# EasyEDA Pro project ProPrj_智能视觉主板1_2024-08-31.epro

# Schematic 主板_1
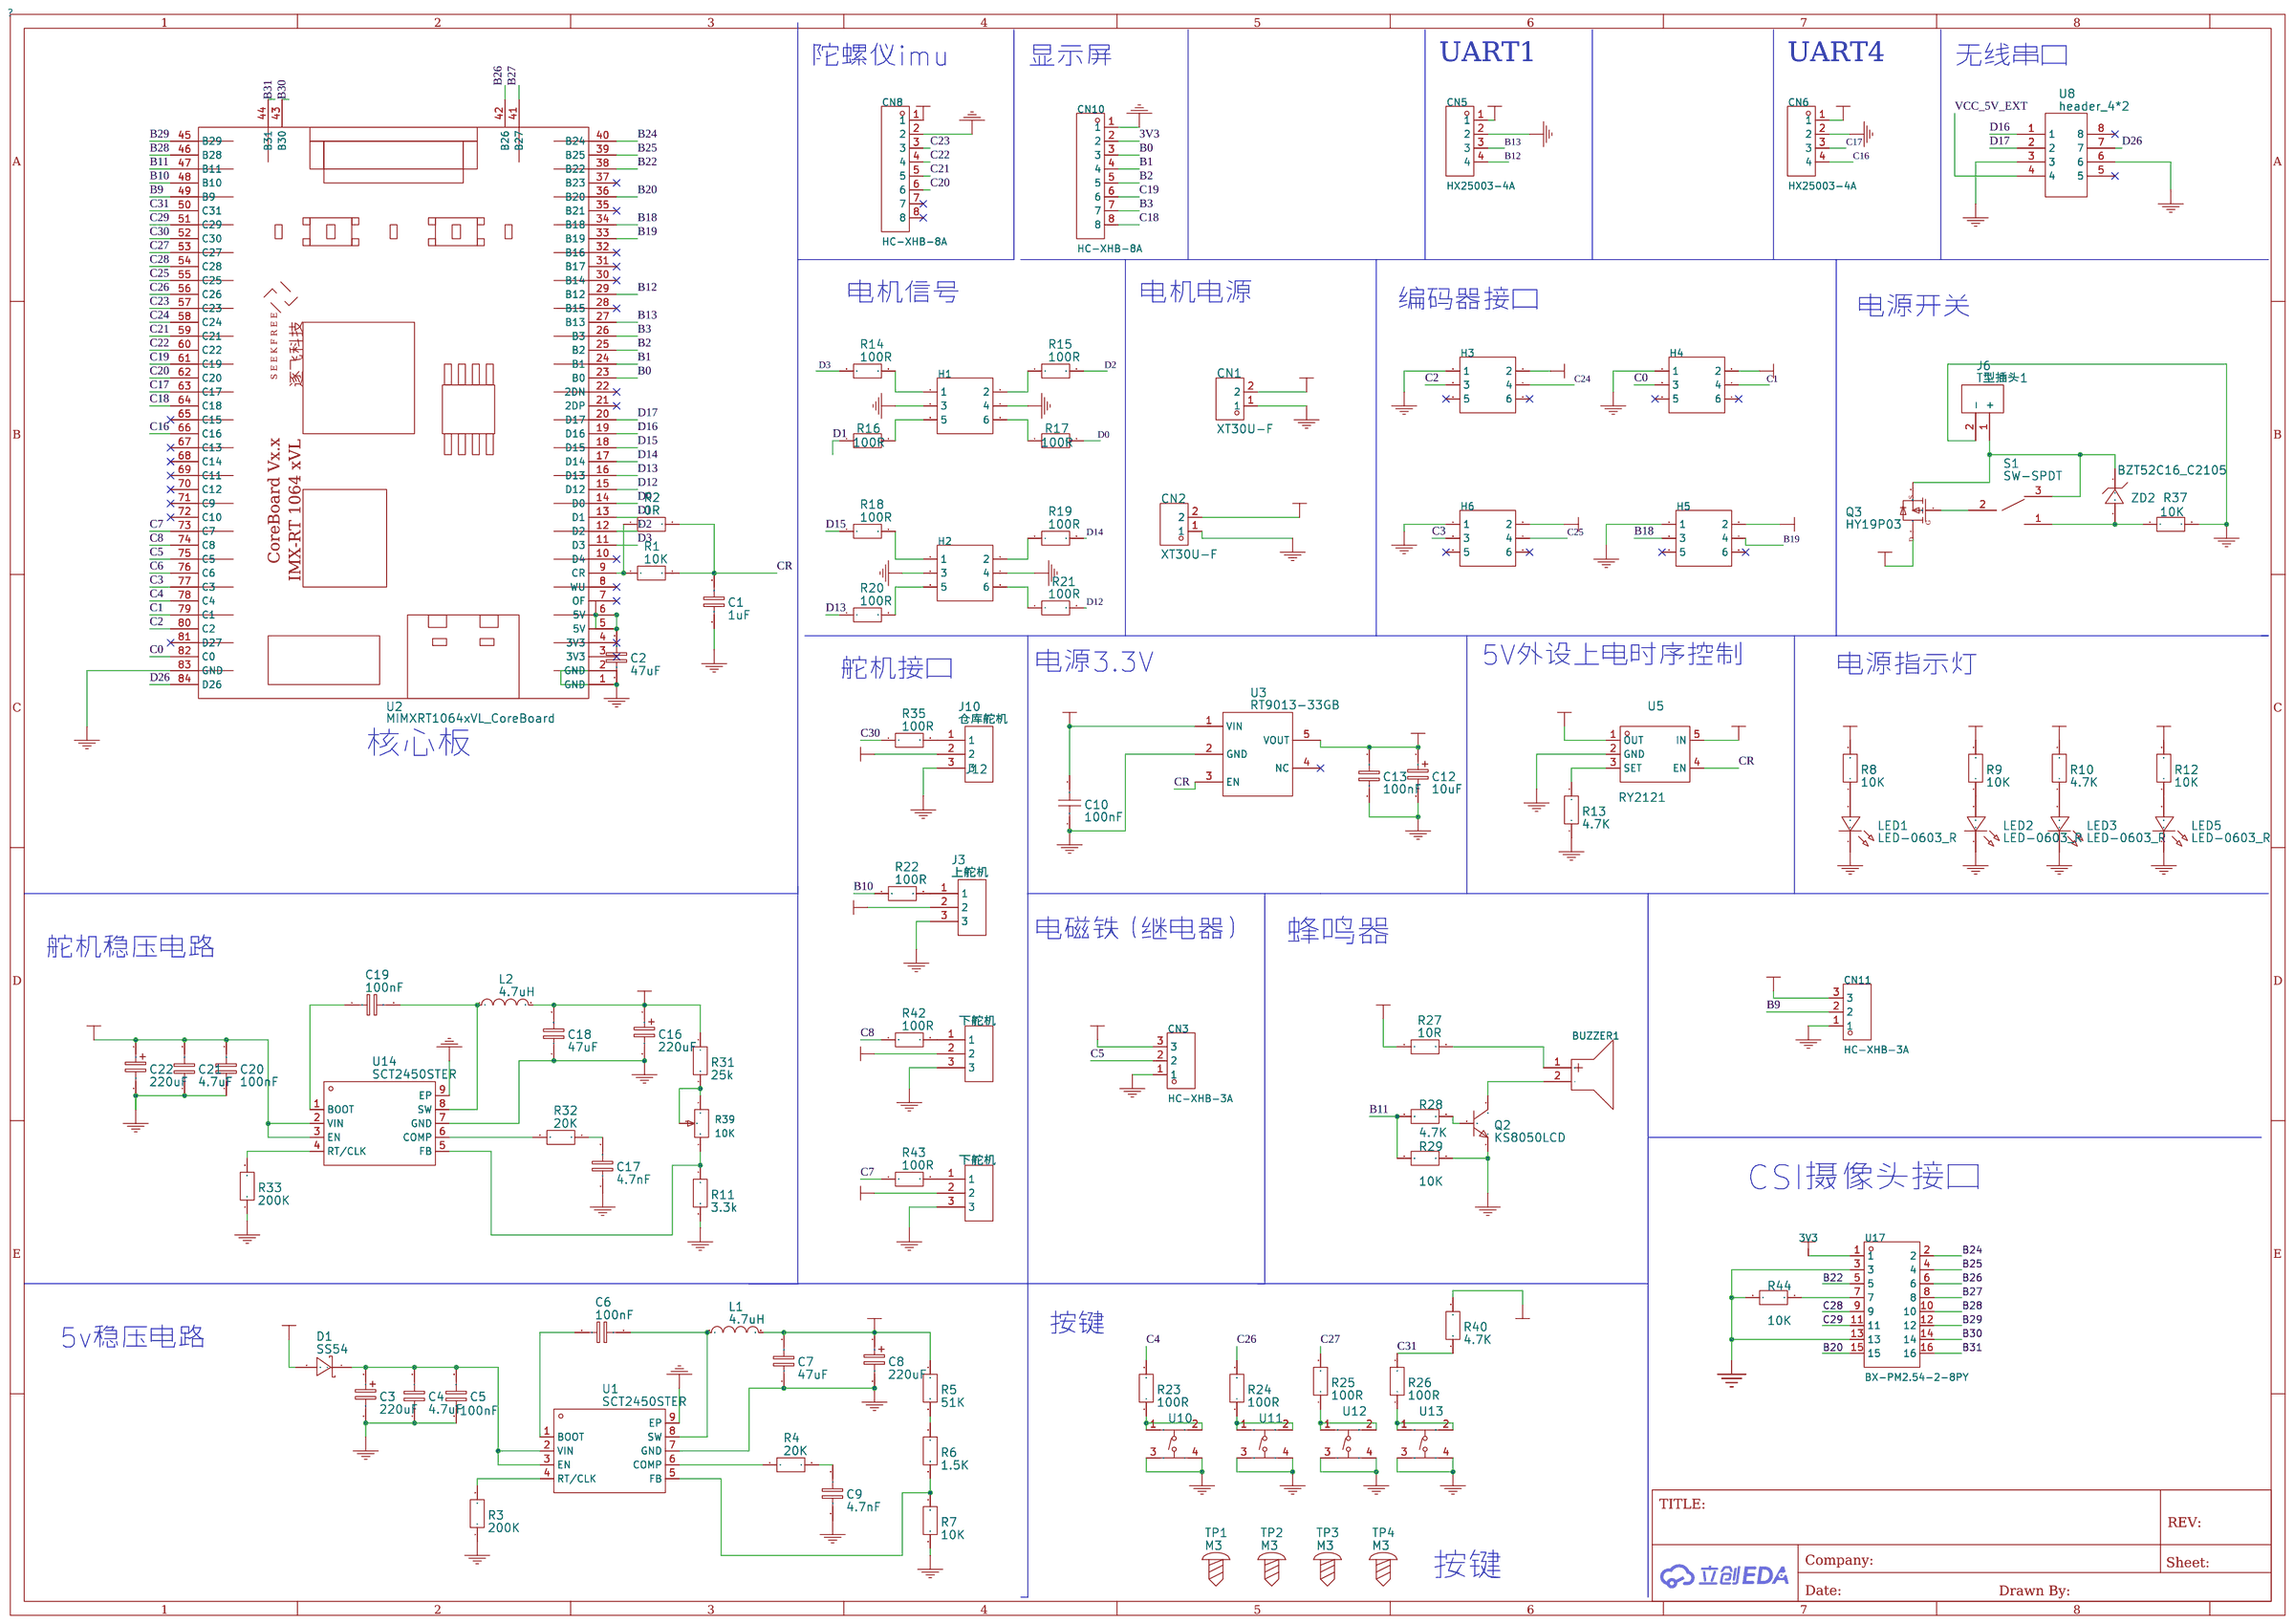
[diagram p0: schematic sheet]

## Parts
BUZZER1  有源蜂鸣器直径9*5.5mm3V  [BUZ-TH_BD9.0-P5.00-D0.6-L-FD]
C1  1uF  [C0603]
C2  47uF  [C0603]
C3  220uF  [贴片铝电解电容6.3*7.7]
C4  4.7uF  [C0603]
C5  100nF  [C0603]
C6  100nF  [C0603]
C7  47uF  [C0603]
C8  220uF  [贴片铝电解电容6.3*7.7]
C9  4.7nF  [C0603]
C10  100nF  [C0603]
C12  10uF  [贴片铝电解电容6.3*7.7]
C13  100nF  [C0603]
C16  220uF  [贴片铝电解电容6.3*7.7]
C17  4.7nF  [C0603]
C18  47uF  [C0603]
C19  100nF  [C0603]
C20  100nF  [C0603]
C21  4.7uF  [C0603]
C22  220uF  [贴片铝电解电容6.3*7.7]
CN1  XT30U-F  [CONN-TH_XT30U-F]
CN2  XT30U-F  [CONN-TH_XT30U-F]
CN3  HC-XHB-3A  [CONN-TH_3P-P2.50_HC-XHB-3A]
CN5  HX25003-4A  [CONN-TH_4P-P2.50_HX25003-4A]
CN6  HX25003-4A  [CONN-TH_4P-P2.50_HX25003-4A]
CN8  HC-XHB-8A  [CONN-TH_8P-P2.50_HCTL_HC-XHB-8A]
CN10  HC-XHB-8A  [CONN-TH_8P-P2.50_HCTL_HC-XHB-8A]
CN11  HC-XHB-3A  [CONN-TH_3P-P2.50_HC-XHB-3A]
D1  SS54  [SS54]
H1  -  [HDR-TH_6P-P2.54-V-F-R2-C3-S2.54]
H2  -  [HDR-TH_6P-P2.54-V-F-R2-C3-S2.54]
H3  -  [HDR-TH_6P-P2.54-V-F-R2-C3-S2.54]
H4  -  [HDR-TH_6P-P2.54-V-F-R2-C3-S2.54]
H5  -  [HDR-TH_6P-P2.54-V-F-R2-C3-S2.54]
H6  -  [HDR-TH_6P-P2.54-V-F-R2-C3-S2.54]
J3  上舵机  [2.54排针1X3]
J6  T型插头1  [T型插头]
J10  仓库舵机  [2.54排针1X3]
J12  下舵机  [2.54排针1X3]
J13  下舵机  [2.54排针1X3]
L1  4.7uH  [IND-SMD_L6.0-W6.0_SMNR6028]
L2  4.7uH  [IND-SMD_L6.0-W6.0_SMNR6028]
LED1  LED-0603_R  [LED0603_RED]
LED2  LED-0603_R  [LED0603_RED]
LED3  LED-0603_R  [LED0603_RED]
LED5  LED-0603_R  [LED0603_RED]
Q2  KS8050LCD  [SOT-23-3_L2.9-W1.3-P1.90-LS2.4-BR]
Q3  HY19P03  [TO-252AA]
R1  10K  [R0603]
R2  0R  [R0603]
R3  200K  [R0603]
R4  20K  [R0603]
R5  51K  [R0603]
R6  1.5K  [R0603]
R7  10K  [R0603]
R8  10K  [R0603]
R9  10K  [R0603]
R10  4.7K  [R0603]
R11  3.3k  [R0603]
R12  10K  [R0603]
R13  4.7K  [R0603]
R14  100R  [R0603]
R15  100R  [R0603]
R16  100R  [R0603]
R17  100R  [R0603]
R18  100R  [R0603]
R19  100R  [R0603]
R20  100R  [R0603]
R21  100R  [R0603]
R22  100R  [R0603]
R23  100R  [R0603]
R24  100R  [R0603]
R25  100R  [R0603]
R26  100R  [R0603]
R27  10R  [R0603]
R28  4.7K  [R0603]
R29  10K  [R0603]
R31  25k  [R0603]
R32  20K  [R0603]
R33  200K  [R0603]
R35  100R  [R0603]
R37  10K  [R0603]
R39  10K  [RES-ADJ-TH_3296W]
R40  4.7K  [R0603]
R42  100R  [R0603]
R43  100R  [R0603]
R44  10K  [R0603]
S1  SW-SPDT  [SS12D10]
TP1  M3  [M3]
TP2  M3  [M3]
TP3  M3  [M3]
TP4  M3  [M3]
U1  SCT2450STER  [ESOP-8_L4.9-W3.9-P1.27-LS6.0-BL-EP]
U2  MIMXRT1064xVL_CoreBoard  [MIMXRT1064XVL_COREBOARD]
U3  RT9013-33GB  [SOT-23-5_L3.0-W1.7-P0.95-LS2.8-BR]
U5  RY2121  [SOT-23-5_L3.0-W1.6-P0.95-LS2.8-BL]
U8  header_4*2  [HEADER_4*2]
U10  贴片按键4*4*3.5M  [KEY-SMD_4P-L5.1-W5.1-P3.70-LS6.5]
U11  贴片按键4*4*3.5M  [KEY-SMD_4P-L5.1-W5.1-P3.70-LS6.5]
U12  贴片按键4*4*3.5M  [KEY-SMD_4P-L5.1-W5.1-P3.70-LS6.5]
U13  贴片按键4*4*3.5M  [KEY-SMD_4P-L5.1-W5.1-P3.70-LS6.5]
U14  SCT2450STER  [ESOP-8_L4.9-W3.9-P1.27-LS6.0-BL-EP]
U17  BX-PM2.54-2-8PY  [HDR-TH_16P-P2.54-V-F-R2-C8-S2.54-1]
ZD2  BZT52C16_C2105  [SOD-123_L2.8-W1.8-LS3.7-RD]

## Library data of the parts
BUZZER1 = 有源蜂鸣器直径9*5.5mm3V: Supplier Part: C9900012728; Supplier Footprint: 0905; JLCPCB Part Class: Extended Part; Datasheet: https://atta.szlcsc.comnull; Supplier: LCSC; Check: true
C1 C2 C9 C17 = 0.1u
C3 C8 C16 C22 = 220uF
C4 C21 = 4.7uF
C5 C6 C10 C13 C19 C20 = 100nF
C7 C18 = 47uF
C12 = 10uF
CN1 CN2 = XT30U-F: 类别:-;类型1:-;; LCSC Part Name: AMASS(艾迈斯)轻量版锂电池插头母头 XT30U-F; Supplier Part: C99102; Manufacturer: AMASS(艾迈斯); JLCPCB Part Class: Extended Part; Datasheet: https://atta.szlcsc.com/upload/public/pdf/source/20190916/C428721_B0ECB8C5937139CEFE8736D2D3175B0E.pdf; Supplier: LCSC; Brand: 艾迈斯; Type: 插头; Colour: 黄色; InterfaceType: 母头
CN3 CN11 = HC-XHB-3A_C2845491: 参考系列:-;间距:2.5mm;插针结构:1x3P;排数:1;每排PIN数:3;行距:-;公母:公型插针;安装方式:直插;额定电流:3A;工作温度范围:-25℃~+85℃;; LCSC Part Name: 2.54带锁扣立式插件 3P 针座连接器线对板/线对线连接器; Supplier Part: C2845491; Manufacturer: HCTL(华灿天禄); Supplier Footprint: 插件,P=2.5mm; JLCPCB Part Class: Extended Part; Datasheet: https://atta.szlcsc.com/upload/public/pdf/source/20210728/C2845490_C6E0123D5C5ECC46C6D4C91ADB43F484.pdf; Supplier: LCSC; Pitch: 2.5mm; Pins Structure: 1x3P; Number of Rows: 1; Number of PINs Per Row: 3; Gender: 公型插针; Mounting Style: 直插; Current Rating (Max): 3A; Operating Temperature Range: -25℃~+85℃
CN5 CN6 = HX25003-4A: 参考系列:XH;间距:2.5mm;插针结构:1x4P;排数:1;每排PIN数:4;行距:-;公母:公型插针;安装方式:直插;额定电流:-;工作温度范围:-;; LCSC Part Name: XH 2.5mm 1x4P 直插; Supplier Part: C442301; Manufacturer: HX(红星); Supplier Footprint: 插件,P=2.5mm; JLCPCB Part Class: Extended Part; Datasheet: https://atta.szlcsc.com/upload/public/pdf/source/20191028/C442301_3A3D3A554E5F0CBC5D03B496CD495BC6.pdf; Supplier: LCSC; Reference Series: XH; Pitch: 2.5mm; Pins Structure: 1x4P; Number of Rows: 1; Number of PINs Per Row: 4; Gender: 公型插针; Mounting Style: 直插
CN8 CN10 = HC-XHB-8A: 参考系列:-;间距:2.5mm;插针结构:1x8P;排数:1;每排PIN数:8;行距:-;公母:公型插针;安装方式:直插;额定电流:3A;工作温度范围:-25℃~+85℃;; LCSC Part Name: 2.54带锁扣立式插件 8P 针座连接器线对板/线对线连接器; Supplier Part: C2845496; Manufacturer: HCTL(华灿天禄); Supplier Footprint: 插件,P=2.5mm; JLCPCB Part Class: Extended Part; Datasheet: https://atta.szlcsc.com/upload/public/pdf/source/20210728/C2845490_C6E0123D5C5ECC46C6D4C91ADB43F484.pdf; Supplier: LCSC; Pitch: 2.5mm; Pins Structure: 1x8P; Number of Rows: 1; Number of PINs Per Row: 8; Gender: 公型插针; Mounting Style: 直插; Current Rating (Max): 3A; Operating Temperature Range: -25℃~+85℃
D1 = SS54
H1-H6 = HDR-F_2.54_2x3: Supplier Part: C92272; Supplier Footprint: 插件
J3 J10 J12 J13 = 舵机
J6 = T型插头1: Supplier: 逐飞科技
L1 L2 = SMNR6028-680MT: Supplier: LCSC; Supplier Part: C266433; Manufacturer: ShunXiang Connaught Elec; JLCPCB Part Class: Extended Part
LED1-LED3 LED5 = 19-217/R6C-AL1M2VY/3T: Manufacturer: EVERLIGHT(台湾亿光); Supplier Part: C72044; Supplier: LCSC
Q2 = KS8050LCD: Supplier: LCSC; Supplier Part: C379932; Manufacturer: Kodenshi AUK; JLCPCB Part Class: Extended Part
Q3 = HY19P03
R1 = 10k
R2 = 0R
R3 R33 = 200K
R4 R22 R27-R29 R32 R35 R42-R44 = 1k
R5 R31 = 51K
R6 = 1.5K
R7-R11 R37 = 10K
R12 R13 = 4.7K
R14-R21 R23-R26 R40 = 100R
R39 = 3296W-1-103LF: 阻值:10kΩ;精度:±10%;; LCSC Part Name: 10kΩ ±10%; Supplier Part: C34846; Manufacturer: BOURNS; Supplier Footprint: 插件; JLCPCB Part Class: Extended Part; Datasheet: https://atta.szlcsc.com/upload/public/pdf/source/20151026/1457707501065.pdf; Supplier: LCSC; Tolerance: ±10%
S1 = SW-SPDT: Published: 24-Mar-1999; Publisher: Altium Limited; Price(RMB): 0.000
TP1-TP4 = M3
U1 U14 = SCT2450STER: Supplier: LCSC; Supplier Part: C509400; Manufacturer: SCT; JLCPCB Part Class: Extended Part
U2 = MIMXRT1064xVL_CoreBoard
U3 = RT9013-33GB: Supplier: LCSC; Manufacturer: RICHTEK; Supplier Part: C47773; JLCPCB Part Class: Extended Part
U5 = RY2121: Supplier: LCSC; Supplier Part: C2887853; Manufacturer: RYCHiP(蕊源)
U8 = header_4*2: Supplier: LCSC
U10-U13 = 贴片按键4*4*3.5m: Supplier: LCSC; Supplier Part: C9900003340; Manufacturer: null; JLCPCB Part Class: Extended Part
U17 = BX-PM2.54-2-8PY: 插孔结构:2x8P;间距:2.54mm;行距:2.54mm;圆孔/方孔:方孔;安装类型:直插;排数:双排;总孔位数:8P;额定电流:3A;额定电压:1kV;插孔方向:顶部;塑高:8.5mm;触头材质:青铜;触头镀层:金;工作温度范围:-40℃~+105℃;焊接温度(最大值):260℃@5S;; LCSC Part Name: 间距:2.54mm 2x8P 直插; Supplier Part: C18078147; Manufacturer: Bossie(博锡); Supplier Footprint: 插件,P=2.54mm; Datasheet: https://atta.szlcsc.com/upload/public/pdf/source/20231017/F143EE84D9AE7C71087314E57604668B.pdf; Supplier: LCSC; Holes Structure: 2x8P; Pitch: 2.54mm; Row Spacing: 2.54mm; Circular Hole / Square Hole: 方孔; Mounting Type: 直插; Number of Rows: 双排; Number of Holes: 8P; Current Rating (Max): 3A; Voltage Rating (Max): 1kV; Holes Direction: 顶部; Insulation Height: 8.5mm; Contact Material: 青铜; Contact Plating: 金; Operating Temperature Range: -40℃~+105℃; Soldering Temperature(Max): 260℃@5S
ZD2 = BZT52C16: Supplier: LCSC; Manufacturer: CJ; Supplier Part: C2105; JLCPCB Part Class: Extended Part

## Nets
3V3: C12.1 C13.2 CN8.1 CN10.2 H3.2 H4.2 H5.2 H6.2 R10.2 R27.1 R40.2 U3.5(VOUT) U17.1
GND: C1.1 C2.1 C3.2 C4.1 C5.1 C7.1 C8.2 C9.1 C10.1 C12.2 C13.1 C16.2 C17.1 C18.1 C20.1 C21.1 C22.2 CN1.1 CN2.1 CN3.1 CN5.2 CN6.2 CN8.2 CN10.1 CN11.1 H1.3 H1.4 H2.3 H2.4 H3.1 H4.1 H5.1 H6.1 J3.3 J6.2(-) J10.3 J12.3 J13.3 LED1.2 LED2.2 LED3.2 LED5.2 Q2.2(E) R3.1 R7.2 R11.2 R13.1 R29.2 R33.1 R37.2 R44.1 U1.7(GND) U1.9(EP) U2.1(GND) U2.2(GND) U2.83(GND) U3.2(GND) U5.2(GND) U8.3 U8.6 U10.3 U10.4 U11.3 U11.4 U12.3 U12.4 U13.3 U13.4 U14.7(GND) U14.9(EP) U17.3 U17.13
VCC_5V: C2.2 C7.2 C8.1 C10.2 L1.2 R5.1 R9.2 U2.5(5V) U2.6(5V) U3.1(VIN) U5.5(IN)
VCC_5V_EXT: CN5.1 CN6.1 R8.2 U5.1(OUT) U8.4
VCC_SERVO: C16.1 C18.2 J3.2 J10.2 J12.2 J13.2 L2.2 R12.2 R31.1
VCCBAT: C20.2 C21.2 C22.1 CN1.2 CN2.2 CN3.3 CN11.3 D1.2(A) Q3.1(D) U14.2(VIN) U14.3(EN)
B0: CN10.3 U2.23(B0)
B1: CN10.4 U2.24(B1)
B2: CN10.5 U2.25(B2)
B3: CN10.7 U2.26(B3)
B9: CN11.2 U2.49(B9)
B10: R22.1 U2.48(B10)
B11: R28.1 R29.1 U2.47(B11)
B12: CN5.4 U2.29(B12)
B13: CN5.3 U2.27(B13)
B18: H5.3 U2.34(B18)
B19: H5.4 U2.33(B19)
B20: U2.36(B20) U17.15
B22: U2.38(B22) U17.5
B24: U2.40(B24) U17.2
B25: U2.39(B25) U17.4
B26: U2.42(B26) U17.6
B27: U2.41(B27) U17.8
B28: U2.46(B28) U17.10
B29: U2.45(B29) U17.12
B30: U2.43(B30) U17.14
B31: U2.44(B31) U17.16
C0: H4.3 U2.82(C0)
C1: H4.4 U2.79(C1)
C2: H3.3 U2.80(C2)
C3: H6.3 U2.77(C3)
C4: R23.2 U2.78(C4)
C5: CN3.2 U2.75(C5)
C6: U2.76(C6)
C7: R43.1 U2.73(C7)
C8: R42.1 U2.74(C8)
C16: CN6.4 U2.66(C16)
C17: CN6.3 U2.63(C17)
C18: CN10.8 U2.64(C18)
C19: CN10.6 U2.61(C19)
C20: CN8.6 U2.62(C20)
C21: CN8.5 U2.59(C21)
C22: CN8.4 U2.60(C22)
C23: CN8.3 U2.57(C23)
C24: H3.4 U2.58(C24)
C25: H6.4 U2.55(C25)
C26: R24.2 U2.56(C26)
C27: R25.2 U2.53(C27)
C28: U2.54(C28) U17.9
C29: U2.51(C29) U17.11
C30: R35.1 U2.52(C30)
C31: R26.2 R40.1 U2.50(C31)
CR: C1.2 R1.2 R2.2 U3.3(EN) U5.4(EN)
D0: R17.2 U2.14(D0)
D1: R16.1 U2.13(D1)
D2: R15.2 U2.12(D2)
D3: R14.1 U2.11(D3)
D12: R21.2 U2.15(D12)
D13: R20.1 U2.16(D13)
D14: R19.2 U2.17(D14)
D15: R18.1 U2.18(D15)
D16: U2.19(D16) U8.1
D17: U2.20(D17) U8.2
D26: U2.84(D26) U8.7
$1N192: R1.1 R2.1 U2.9(CR)
$1N350: C3.1 C4.2 C5.2 D1.1(K) U1.2(VIN) U1.3(EN)
$1N357: R3.2 U1.4(RT/CLK)
$1N362: C6.1 U1.1(BOOT)
$1N385: R5.2 R6.1
$1N386: R6.2 R7.1 U1.5(FB)
$1N395: C9.2 R4.1
$1N400: C6.2 L1.1 U1.8(SW)
$1N409: R4.2 U1.6(COMP)
$1N530: Q2.1(B) R28.2
$1N714: H2.6 R21.1
$1N715: H2.2 R19.1
$1N716: H2.5 R20.2
$1N717: H2.1 R18.2
$1N718: H1.6 R17.1
$1N719: H1.2 R15.1
$1N720: H1.5 R16.2
$1N721: H1.1 R14.2
$1N974: J6.1(+) Q3.3(S) S1.3 ZD2.1(K)
$1N981: R37.1 S1.1 ZD2.2(A)
$1N982: Q3.2(G) S1.2
$1N1264: R13.2 U5.3(SET)
$1N1431: R33.2 U14.4(RT/CLK)
$1N1436: C19.1 U14.1(BOOT)
$1N1460: R11.1 R39.3 U14.5(FB)
$1N1469: C17.2 R32.1
$1N1474: C19.2 L2.1 U14.8(SW)
$1N1483: R32.2 U14.6(COMP)
$1N1533: R26.1 U13.1 U13.2
$1N1534: R25.1 U12.1 U12.2
$1N1535: R24.1 U11.1 U11.2
$1N1536: R23.1 U10.1 U10.2
$1N1878: J10.1 R35.2
$1N1888: J3.1 R22.2
$1N1891: LED3.1 R10.1
$1N1900: LED5.1 R12.1
$1N1901: LED2.1 R9.1
$1N1902: LED1.1 R8.1
$1N3397: R31.2 R39.1 R39.2
$1N17375: BUZZER1.2(-) Q2.3(C)
$1N17379: BUZZER1.1(+) R27.2
$1N18894: J12.1 R42.2
$1N26015: J13.1 R43.2
$1N38676: R44.2 U17.7

Not connected (* = marked no-connect by the designer): CN8 7* 8*; H3 5* 6*; H4 5* 6*; H5 5* 6*; H6 5* 6*; U2 3(3V3)* 4(3V3)* 7(OF)* 8(WU)* 10(D4)* 21(2DP)* 22(2DN)* 28(B15)* 30(B14)* 31(B17)* 32(B16)* 35(B21)* 37(B23)* 65(C15)* 67(C13)* 68(C14)* 69(C11)* 70(C12)* 71(C9)* 72(C10)* 81(D27)*; U3 4(NC)*; U8 5* 8*

## Notes on the sheet
- 陀螺仪imu
- 显示屏
- UART1
- UART4
- 无线串口
- 电机信号
- 电机电源
- 编码器接口
- 电源开关
- 舵机接口
- 电源3.3V
- 5V外设上电时序控制
- 电源指示灯
- 核心板
- 电磁铁（继电器）
- 舵机稳压电路
- 蜂鸣器
- CSI摄像头接口
- 按键
- 5v稳压电路
- 按键

# Board PCB_主板_1
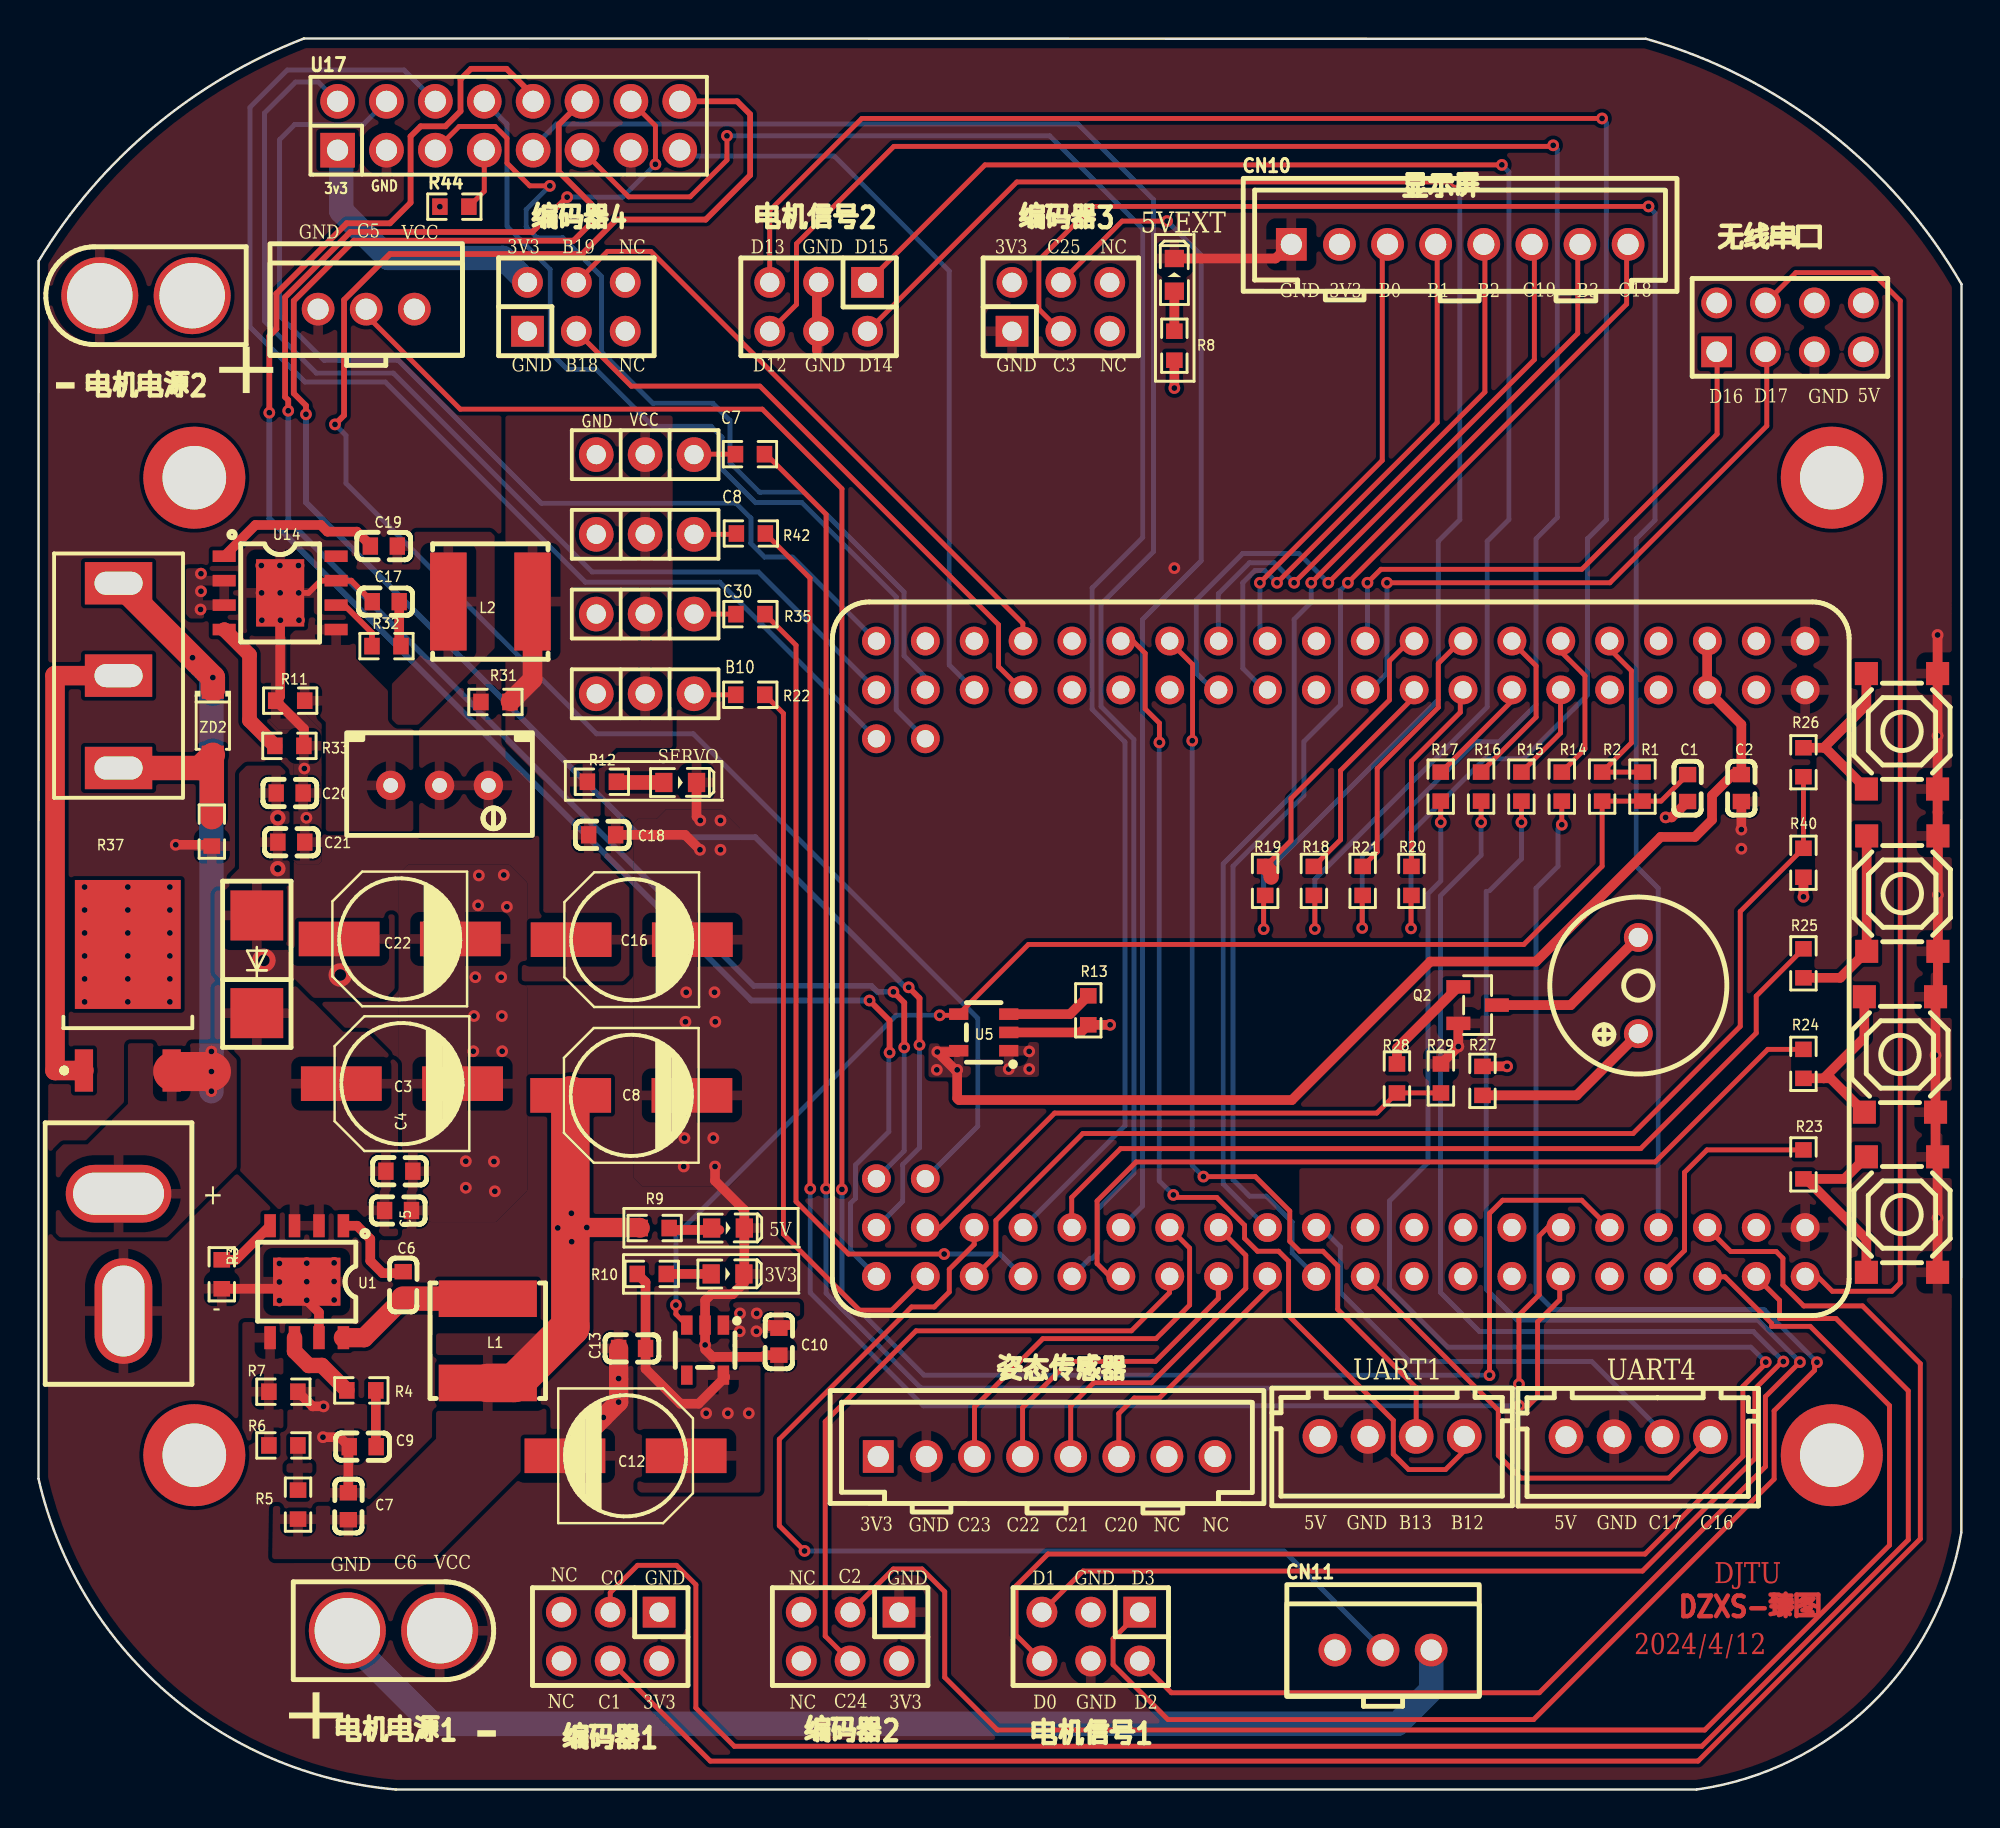
[diagram p1: board, top side]
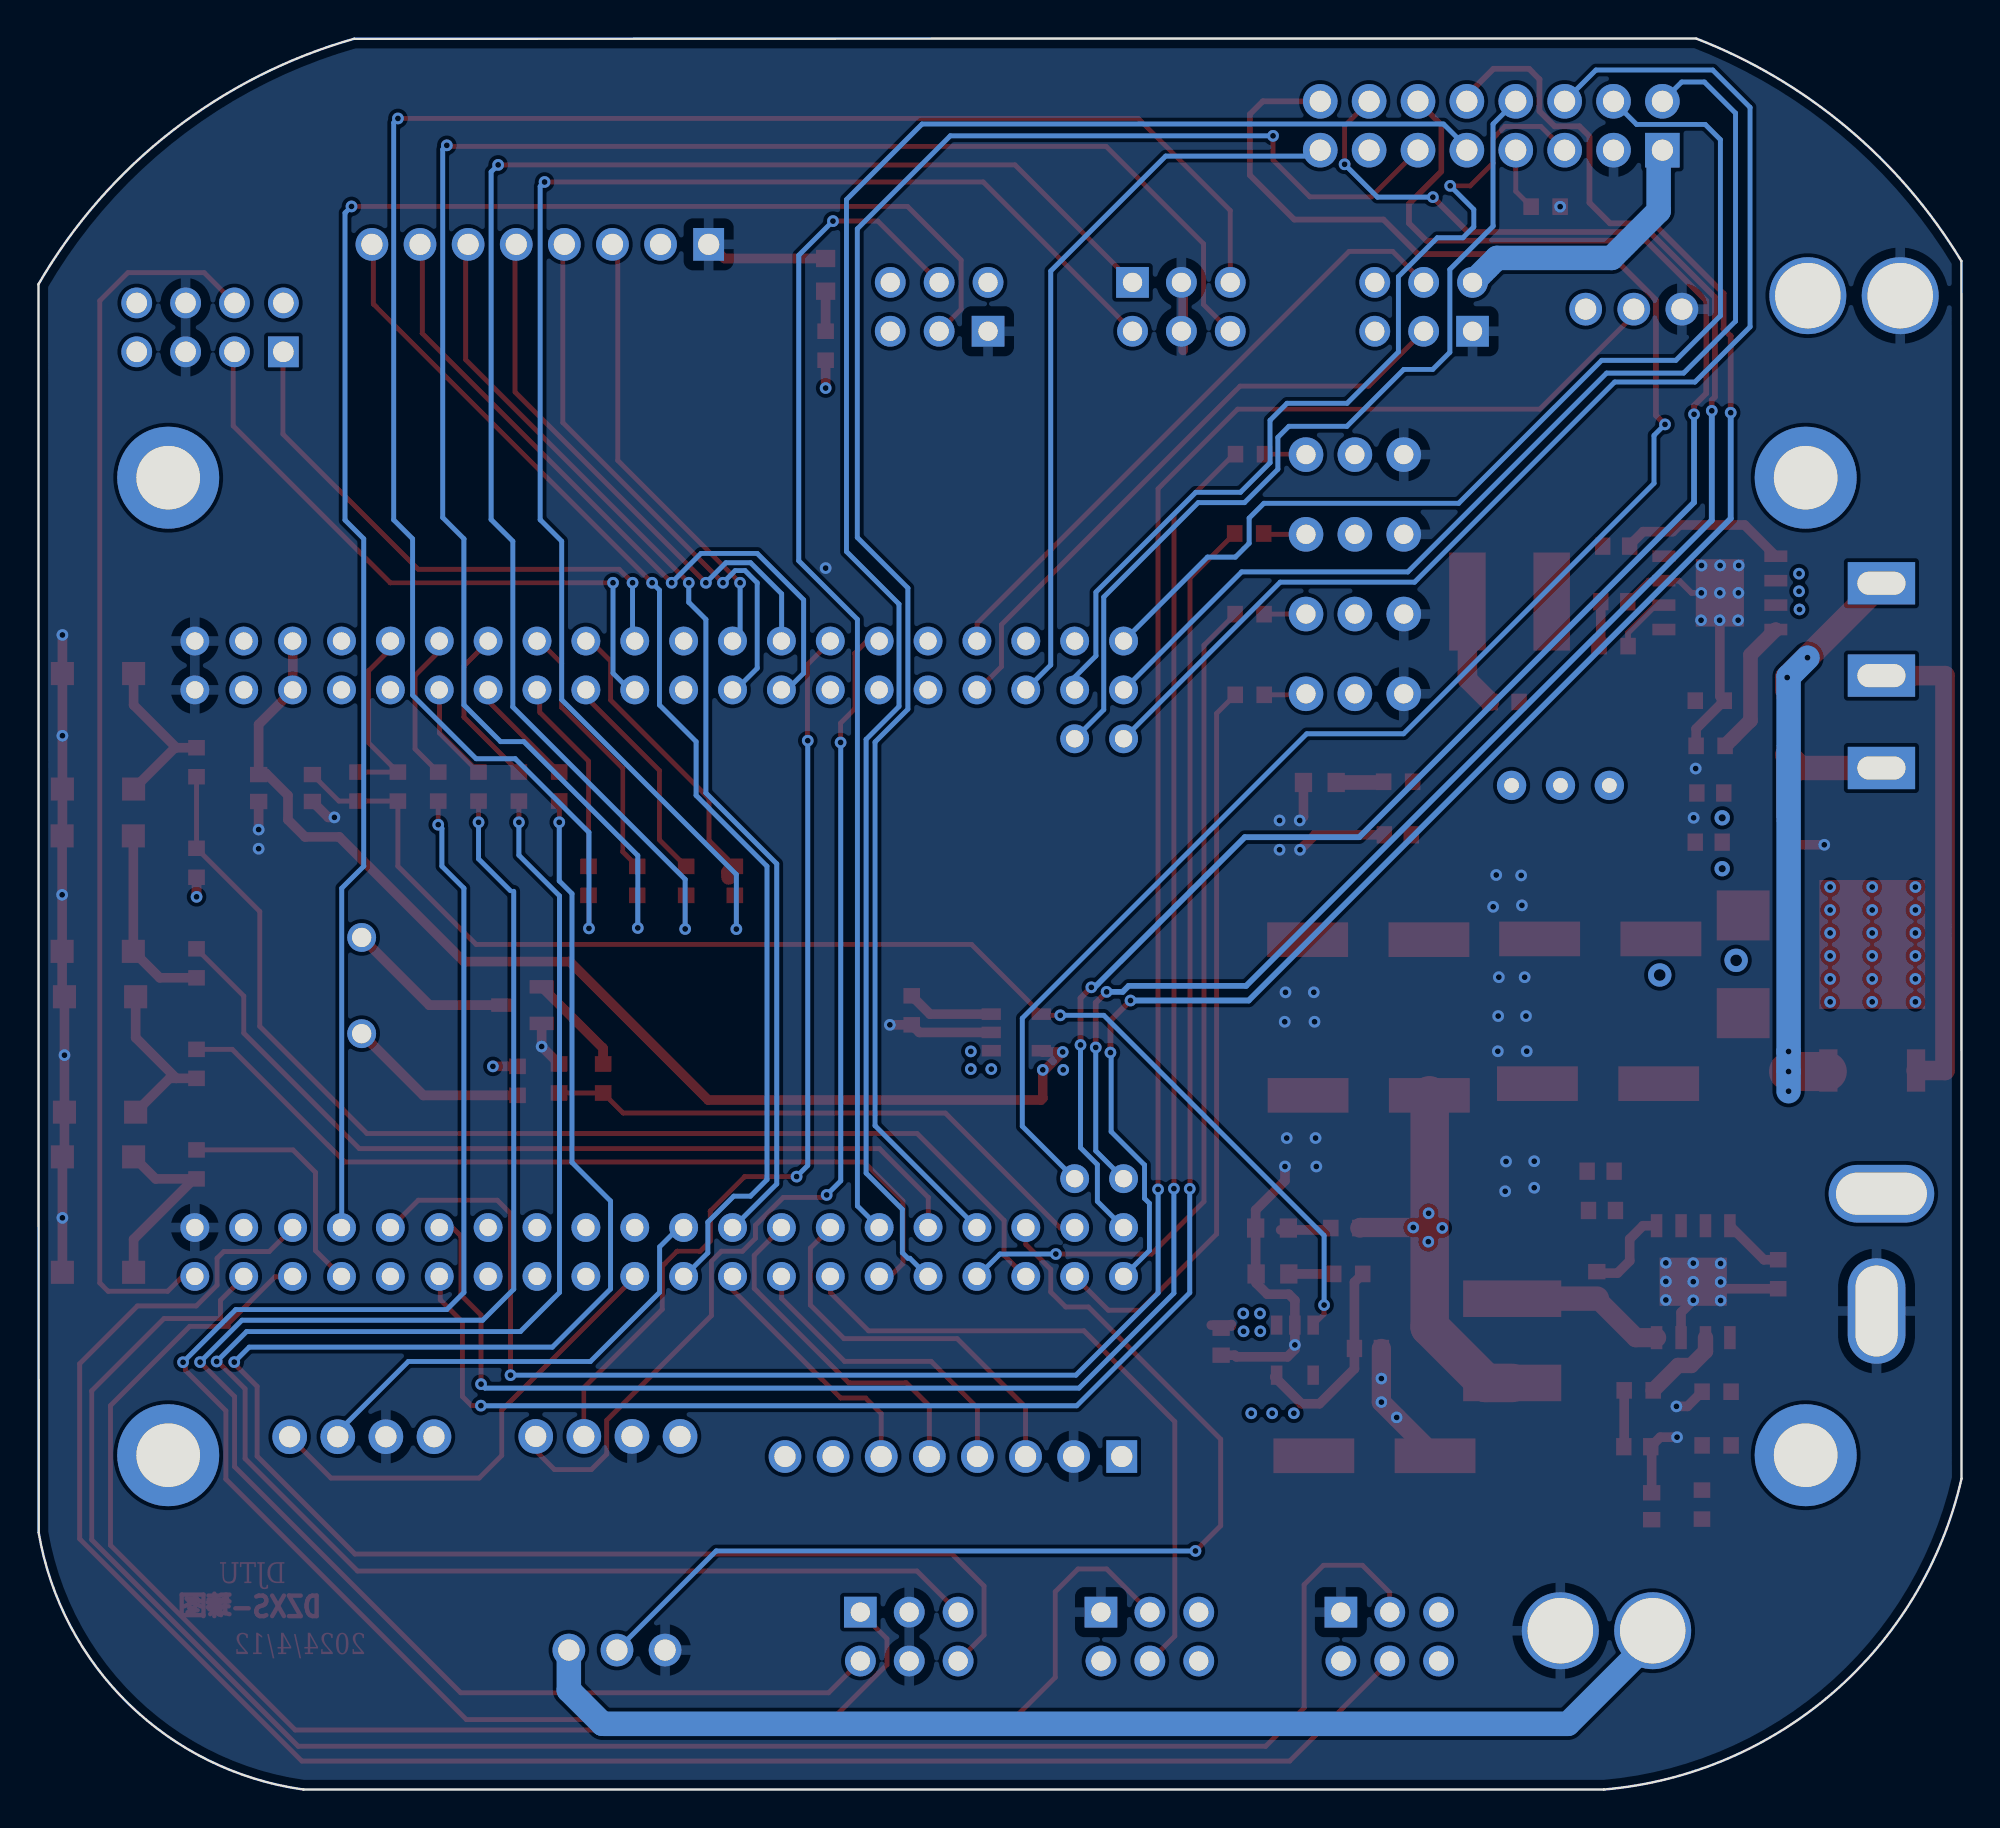
[diagram p2: board, bottom side, seen from below]

Outline 99.93 x 91 mm; copper layers: Top Layer, 接地层, 电源层, Bottom Layer. Coordinates in mm from the lower left corner of the outline.
Outline path: 0.01,79.43 0,16.15 arc(6.66,5.05) 18.58,0 86.16,0 arc(95.22,4.43) 99.92,13.35 99.93,78.23 arc(92.97,86.2) 83.53,90.98 13.79,91 arc(5.94,86.36) 0.01,79.43
Stack: Top Layer 0.035mm / Dielectric1 0.48mm PP er 4.5 / 接地层 0.035mm / Dielectric2 0.48mm FR4 er 4.5 / 电源层 0.035mm / Dielectric3 0.48mm PP er 4.5 / Bottom Layer 0.035mm

## Design rules (mm)
net GND: GND
net 3V3: 3V3
net VCC_5V: 5V
net VCC_5V_EXT: 5V
net VCC_SERVO: VBAT
net VCCBAT: VBAT
template: 用户自定义配置
spacing Default (default): track to track 0.152, other pairs 0 to 0.152
spacing 3V3: track to track 0.201, other pairs 0 to 0.201
spacing 5V: track to track 0.3, other pairs 0 to 0.3
spacing 12V: track to track 0.5, other pairs 0 to 0.5
track width Default (default): min 0.254, default 0.254, max 25.4
track width 3V3: min 0.3, default 0.3, max 25.4
track width 5V: min 0.5, default 0.5, max 25.4
track width 12V: min 0.8, default 0.8, max 25.4
differential pair differentialPair (default): width min 0.127, default 0.254, max 2.54; gap min 0.152, default 0.152
via Default (default): diameter min 0.61, default 0.61, max 100.025; hole min 0.305, default 0.305, max 59.995
via 3V3: diameter min 0.61, default 0.61, max 100.025; hole min 0.305, default 0.305, max 59.995
via 5V: diameter min 0.61, default 0.61, max 100.025; hole min 0.305, default 0.305, max 59.995
via 12V: diameter min 0.61, default 0.61, max 100.025; hole min 0.305, default 0.305, max 59.995
net class GND uses 3V3
net class 3V3 uses 3V3
net class 5V uses 5V
net class VBAT uses 12V
net GND uses 3V3
net 3V3 uses 3V3
net VCC_5V uses 5V
net VCC_5V_EXT uses 5V
net VCC_SERVO uses 12V
net VCCBAT uses 12V

## Placement (name value [footprint] x y rotation side)
BUZZER1  有源蜂鸣器直径9*5.5mm3V  [BUZ-TH_BD9.0-P5.00-D0.6-L-FD]  83.13 41.78 90 top
C1  1uF  [C0603]  85.69 52.04 90 top
C2  47uF  [C0603]  88.49 52.04 90 top
C3  220uF  [贴片铝电解电容6.3*7.7]  18.03 36.68 180 top
C4  4.7uF  [C0603]  18.75 32.13 180 top
C5  100nF  [C0603]  18.68 30.09 180 top
C6  100nF  [C0603]  18.95 26.21 270 top
C7  47uF  [C0603]  16.1 14.72 270 top
C8  220uF  [贴片铝电解电容6.3*7.7]  29.95 36.07 180 top
C9  4.7nF  [C0603]  16.85 17.82 0 top
C10  100nF  [C0603]  38.47 23.27 90 top
C12  10uF  [贴片铝电解电容6.3*7.7]  31.36 17.34 0 top
C13  100nF  [C0603]  30.85 22.92 0 top
C16  220uF  [贴片铝电解电容6.3*7.7]  29.97 44.17 180 top
C17  4.7nF  [C0603]  18.04 61.73 0 top
C18  47uF  [C0603]  29.29 49.61 180 top
C19  100nF  [C0603]  17.95 64.62 0 top
C20  100nF  [C0603]  13.05 51.79 180 top
C21  4.7uF  [C0603]  13.14 49.23 180 top
C22  220uF  [贴片铝电解电容6.3*7.7]  17.91 44.2 180 top
CN1  XT30U-F  [CONN-TH_XT30U-F]  5.59 77.63 180 top
CN2  XT30U-F  [CONN-TH_XT30U-F]  18.45 8.25 0 top
CN3  HC-XHB-3A  [CONN-TH_3P-P2.50_HC-XHB-3A]  17.03 76.93 0 top
CN5  HX25003-4A  [CONN-TH_4P-P2.50_HX25003-4A]  70.34 18.35 0 top
CN6  HX25003-4A  [CONN-TH_4P-P2.50_HX25003-4A]  83.13 18.33 0 top
CN8  HC-XHB-8A  [CONN-TH_8P-P2.50_HCTL_HC-XHB-8A]  52.39 17.31 0 top
CN10  HC-XHB-8A  [CONN-TH_8P-P2.50_HCTL_HC-XHB-8A]  73.85 80.3 0 top
CN11  HC-XHB-3A  [CONN-TH_3P-P2.50_HC-XHB-3A]  69.87 7.25 0 top
D1  -  [SS54]  11.35 42.89 270 top
H1  -  [HDR-TH_6P-P2.54-V-F-R2-C3-S2.54]  54.68 7.95 180 top
H2  -  [HDR-TH_6P-P2.54-V-F-R2-C3-S2.54]  40.54 77.05 180 top
H3  -  [HDR-TH_6P-P2.54-V-F-R2-C3-S2.54]  42.18 7.95 180 top
H4  -  [HDR-TH_6P-P2.54-V-F-R2-C3-S2.54]  29.71 7.95 180 top
H5  -  [HDR-TH_6P-P2.54-V-F-R2-C3-S2.54]  27.95 77.05 0 top
H6  -  [HDR-TH_6P-P2.54-V-F-R2-C3-S2.54]  53.13 77.05 0 top
J3  上舵机  [2.54排针1X3]  31.52 56.94 180 top
J6  T型插头1  [T型插头]  4.16 30.96 270 top
J10  仓库舵机  [2.54排针1X3]  31.52 61.09 180 top
J12  下舵机  [2.54排针1X3]  31.52 65.23 180 top
J13  下舵机  [2.54排针1X3]  31.52 69.37 180 top
L1  4.7uH  [IND-SMD_L6.0-W6.0_SMNR6028]  23.35 23.32 270 top
L2  4.7uH  [IND-SMD_L6.0-W6.0_SMNR6028]  23.48 61.74 0 top
LED1  LED-0603_R  [LED0603_RED]  59.02 78.71 90 top
LED2  LED-0603_R  [LED0603_RED]  35.83 29.18 0 top
LED3  LED-0603_R  [LED0603_RED]  35.81 26.79 0 top
LED5  LED-0603_R  [LED0603_RED]  33.35 52.33 0 top
Q2  KS8050LCD  [SOT-23-3_L2.9-W1.3-P1.90-LS2.4-BR]  74.78 40.76 180 top
Q3  HY19P03  [TO-252AA]  4.64 40.64 90 top
R1  10K  [R0603]  83.35 52.12 270 top
R2  0R  [R0603]  81.25 52.12 270 top
R3  200K  [R0603]  9.53 26.78 90 top
R4  20K  [R0603]  16.78 20.74 180 top
R5  51K  [R0603]  13.49 14.81 90 top
R6  1.5K  [R0603]  12.73 17.88 180 top
R7  10K  [R0603]  12.73 20.67 0 top
R8  10K  [R0603]  59.02 75.03 270 top
R9  10K  [R0603]  32.02 29.18 180 top
R10  4.7K  [R0603]  31.87 26.79 180 top
R11  3.3k  [R0603]  13.08 56.59 180 top
R12  10K  [R0603]  29.28 52.37 180 top
R13  4.7K  [R0603]  54.55 40.49 90 top
R14  100R  [R0603]  79.16 52.12 270 top
R15  100R  [R0603]  77.06 52.12 90 top
R16  100R  [R0603]  74.96 52.12 270 top
R17  100R  [R0603]  72.87 52.12 90 top
R18  100R  [R0603]  66.28 47.22 270 top
R19  100R  [R0603]  63.74 47.22 90 top
R20  100R  [R0603]  71.34 47.22 270 top
R21  100R  [R0603]  68.81 47.22 90 top
R22  100R  [R0603]  36.99 56.89 180 top
R23  100R  [R0603]  91.71 32.49 90 top
R24  100R  [R0603]  91.71 37.71 90 top
R25  100R  [R0603]  91.71 42.94 90 top
R26  100R  [R0603]  91.71 53.39 270 top
R27  10R  [R0603]  75.04 36.83 270 top
R28  4.7K  [R0603]  70.59 36.95 90 top
R29  10K  [R0603]  72.88 36.95 90 top
R31  25k  [R0603]  23.74 56.52 180 top
R32  20K  [R0603]  18.08 59.42 180 top
R33  200K  [R0603]  13.04 54.24 180 top
R35  100R  [R0603]  37 61.08 180 top
R37  10K  [R0603]  9.01 49.78 270 top
R39  10K  [RES-ADJ-TH_3296W]  20.84 52.18 270 top
R40  4.7K  [R0603]  91.71 48.16 270 top
R42  100R  [R0603]  37.02 65.27 180 top
R43  100R  [R0603]  36.97 69.4 180 top
R44  10K  [R0603]  21.61 82.26 0 top
S1  SW-SPDT  [SS12D10]  4.16 57.89 90 top
TP1  -  [M3]  93.19 68.17 0 top
TP2  -  [M3]  93.19 17.37 0 top
TP3  -  [M3]  8.1 68.17 0 top
TP4  -  [M3]  8.1 17.37 0 top
U1  SCT2450STER  [ESOP-8_L4.9-W3.9-P1.27-LS6.0-BL-EP]  13.94 26.39 180 top
U2  MIMXRT1064xVL_CoreBoard  [MIMXRT1064XVL_COREBOARD]  67.67 43.18 180 top
U3  RT9013-33GB  [SOT-23-5_L3.0-W1.7-P0.95-LS2.8-BR]  34.64 22.83 90 top
U5  RY2121  [SOT-23-5_L3.0-W1.6-P0.95-LS2.8-BL]  49.12 39.34 90 top
U8  header_4*2  [HEADER_4*2]  94.82 74.71 180 top
U10  贴片按键4*4*3.5M  [KEY-SMD_4P-L5.1-W5.1-P3.70-LS6.5]  96.83 29.88 90 top
U11  贴片按键4*4*3.5M  [KEY-SMD_4P-L5.1-W5.1-P3.70-LS6.5]  96.73 38.2 90 top
U12  贴片按键4*4*3.5M  [KEY-SMD_4P-L5.1-W5.1-P3.70-LS6.5]  96.85 46.56 90 top
U13  贴片按键4*4*3.5M  [KEY-SMD_4P-L5.1-W5.1-P3.70-LS6.5]  96.83 54.99 90 top
U14  SCT2450STER  [ESOP-8_L4.9-W3.9-P1.27-LS6.0-BL-EP]  12.56 62.19 270 top
U17  BX-PM2.54-2-8PY  [HDR-TH_16P-P2.54-V-F-R2-C8-S2.54-1]  24.43 86.46 0 top
ZD2  BZT52C16_C2105  [SOD-123_L2.8-W1.8-LS3.7-RD]  9.06 55.47 270 top

## Footprints (pads in the part's own frame, mm; a bottom-side part is the same pattern mirrored in y, then rotated)
2.54排针1X3
  round 1.8 hole 1: 1(-2.54,0) 2(0,0) 3(2.54,0)
BUZ-TH_BD9.0-P5.00-D0.6-L-FD
  round 1.5 hole 1: 1(-2.5,0) 2(2.5,0)
C0603
  rect 0.8x0.9 smd: 1(-0.7,0) 2(0.7,0)
CONN-TH_3P-P2.50_HC-XHB-3A
  round 1.7 hole 1.1: 1(-2.5,0) 2(0,0) 3(2.5,0)
CONN-TH_4P-P2.50_HX25003-4A
  round 1.8 hole 1.1: 1(-3.75,0) 2(-1.25,0) 3(1.25,0) 4(3.75,0)
CONN-TH_8P-P2.50_HCTL_HC-XHB-8A
  rect 1.6x1.7 hole 1.1: 1(-8.75,0)
  round 1.7 hole 1.1: 2(-6.25,0) 3(-3.75,0) 4(-1.25,0) 5(1.25,0) 6(3.75,0) 7(6.25,0) 8(8.75,0)
CONN-TH_XT30U-F
  round 4 hole 3.4: 1(2.4,0) 2(-2.4,0)
ESOP-8_L4.9-W3.9-P1.27-LS6.0-BL-EP
  rect 0.6x1.2 smd: 1(-1.905,-2.909) 2(-0.635,-2.909) 3(0.635,-2.909) 4(1.905,-2.909) 5(1.905,2.909) 6(0.635,2.909) 7(-0.635,2.909) 8(-1.905,2.909)
  rect 3.5x2.5 smd: 9(0,0)
HDR-TH_6P-P2.54-V-F-R2-C3-S2.54
  rect 1.7x1.6 hole 1: 1(-2.54,-1.27)
  round 1.6 hole 1: 2(-2.54,1.27) 3(0,-1.27) 4(0,1.27) 5(2.54,-1.27) 6(2.54,1.27)
HDR-TH_16P-P2.54-V-F-R2-C8-S2.54-1
  rect 1.8x1.8 hole 1.1: 1(-8.89,-1.27)
  round 1.8 hole 1.1: 2(-8.89,1.27) 3(-6.35,-1.27) 4(-6.35,1.27) 5(-3.81,-1.27) 6(-3.81,1.27) 7(-1.27,-1.27) 8(-1.27,1.27) 9(1.27,-1.27) 10(1.27,1.27) 11(3.81,-1.27) 12(3.81,1.27) 13(6.35,-1.27) 14(6.35,1.27) 15(8.89,-1.27) 16(8.89,1.27)
HEADER_4*2
  rect 1.6x1.6 hole 1.067: 1(7.62,0)
  round 1.6 hole 1.067: 2(5.08,0) 3(2.54,0) 4(0,0) 5(0,-2.54) 6(2.54,-2.54) 7(5.08,-2.54) 8(7.62,-2.54)
IND-SMD_L6.0-W6.0_SMNR6028
  rect 1.9x5.1 smd: 1(-2.188,0) 2(2.188,0)
KEY-SMD_4P-L5.1-W5.1-P3.70-LS6.5
  rect 1.2x1.2 smd: 1(-3,1.85) 2(3,1.85) 3(-3,-1.85) 4(3,-1.85)
LED0603_RED
  rect 0.9x1 smd: 1(-0.85,0) 2(0.85,0)
M3
  round 5.3 hole 3.305x3.3: 1(0,0)
MIMXRT1064XVL_COREBOARD
  round 1.5 hole 0.9: 1(-24.13,-16.51) 2(-24.13,-13.97) 3(-21.59,-16.51) 4(-21.59,-13.97) 5(-19.05,-16.51) 6(-19.05,-13.97) 7(-16.51,-16.51) 8(-16.51,-13.97) 9(-13.97,-16.51) 10(-13.97,-13.97) 11(-11.43,-16.51) 12(-11.43,-13.97) 13(-8.89,-16.51) 14(-8.89,-13.97) 15(-6.35,-16.51) 16(-6.35,-13.97) 17(-3.81,-16.51) 18(-3.81,-13.97) 19(-1.27,-16.51) 20(-1.27,-13.97) 21(1.27,-16.51) 22(1.27,-13.97) 23(3.81,-16.51) 24(3.81,-13.97) 25(6.35,-16.51) 26(6.35,-13.97) 27(8.89,-16.51) 28(8.89,-13.97) 29(11.43,-16.51) 30(11.43,-13.97) 31(13.97,-16.51) 32(13.97,-13.97) 33(16.51,-16.51) 34(16.51,-13.97) 35(19.05,-16.51) 36(19.05,-13.97) 37(21.59,-16.51) 38(21.59,-13.97) 39(24.13,-16.51) 40(24.13,-13.97) 41(21.59,-11.43) 42(24.13,-11.43) 43(24.13,11.43) 44(21.59,11.43) 45(24.13,13.97) 46(24.13,16.51) 47(21.59,13.97) 48(21.59,16.51) 50(19.05,16.51) 51(16.51,13.97) 52(16.51,16.51) 53(13.97,13.97) 54(13.97,16.51) 55(11.43,13.97) 56(11.43,16.51) 57(8.89,13.97) 58(8.89,16.51) 59(6.35,13.97) 60(6.35,16.51) 61(3.81,13.97) 62(3.81,16.51) 63(1.27,13.97) 64(1.27,16.51) 65(-1.27,13.97) 66(-1.27,16.51) 67(-3.81,13.97) 68(-3.81,16.51) 69(-6.35,13.97) 70(-6.35,16.51) 71(-8.89,13.97) 72(-8.89,16.51) 73(-11.43,13.97) 74(-11.43,16.51) 75(-13.97,13.97) 76(-13.97,16.51) 77(-16.51,13.97) 78(-16.51,16.51) 79(-19.05,13.97) 80(-19.05,16.51) 81(-21.59,13.97) 82(-21.59,16.51) 83(-24.13,13.97) 84(-24.13,16.51)
  round 1.5 hole 0.905x0.9: 49(19.05,13.97)
R0603
  rect 0.806x0.864 smd: 1(-0.753,0) 2(0.753,0)
RES-ADJ-TH_3296W
  round 1.524 hole 0.762: 1(0,2.54) 2(0,0) 3(0,-2.54)
SOD-123_L2.8-W1.8-LS3.7-RD
  rect 0.95x1.15 smd: 1(-1.692,0) 2(1.692,0)
SOT-23-3_L2.9-W1.3-P1.90-LS2.4-BR
  rect 1.25x0.7 smd: 1(1,-0.95) 2(1,0.95) 3(-1,0)
SOT-23-5_L3.0-W1.6-P0.95-LS2.8-BL
  rect 0.6x1 smd: 1(-0.95,-1.3) 2(0,-1.3) 3(0.95,-1.3) 4(0.95,1.3) 5(-0.95,1.3)
SOT-23-5_L3.0-W1.7-P0.95-LS2.8-BR
  rect 1x0.6 smd: 1(1.3,-0.95) 2(1.3,0) 3(1.3,0.95) 4(-1.3,0.95) 5(-1.3,-0.95)
SS12D10
  rect 2.2x3.5 hole 1.2x2.5: 1(-4.8,0) 2(0,0) 3(4.8,0)
SS54
  rect 2.6x2.743 smd: 1(2.54,0) 2(-2.54,0)
TO-252AA
  rect 6.7x5.5 smd: 1(3.275,0)
  rect 2.2x0.95 smd: 2(-3.275,2.28) 3(-3.275,-2.28)
T型插头
  oval 2.997x5.486 hole 2.184x4.724: 1(0,0)
  oval 5.486x2.997 hole 4.724x2.184: 2(6.096,0.254)
贴片铝电解电容6.3*7.7
  rect 4.2x1.8 smd: 1(2.292,0.001) 2(-4.008,0.001)

## Nets
As in the schematic.

Pads without a net: CN8 7 8; H3 5 6; H4 5 6; H5 5 6; H6 5 6; TP1 1; TP2 1; TP3 1; TP4 1; U2 3 4 7 8 10 21 22 28 30 31 32 35 37 65 67 68 69 70 71 72 81; U3 4; U8 5 8

## Via types
v1: diameter 0.61, hole 0.305, Top Layer to Bottom Layer, 165 vias
v2: diameter 0.8, hole 0.381, Top Layer to Bottom Layer, 2 vias
v3: diameter 1.219, hole 0.61, Top Layer to Bottom Layer, 2 vias

## Routing (per net, layer and track width the routed paths; a pad name or vN(x,y) marks a point on that pad's centre or on a via; arc(x,y) is an arc through that point)
3V3: length 238.8
  Top Layer w0.482: U3.5 35.69,21.44
  Top Layer w0.5: 75,37.6 75.01,37.58 v1(76.31,37.58) ; R10.2 31.55,26.36 C13.2 31.55,21.86 33.36,20.05 34.3,20.05 35.69,21.44
  Top Layer w0.508: R40.2 v1(91.71,46.39)
  电源层 w0.482: v1(76.31,37.58) 76.29,37.6 ; 72.74,54.71 72.74,62.59
  电源层 w0.5: 75.31,36.12 75.31,25.05 ; 76.31,37.12 v1(76.31,37.58)
  电源层 w1.016: v1(91.71,46.39) 87.28,41.96 82.32,41.96 77.94,37.58 v1(76.31,37.58) ; 76.29,37.6 76.29,45.06 71.4,49.96 71.4,53.37 72.74,54.71 ; 43.56,17.38 43.56,18.82 48.91,24.16 74.42,24.16 75.31,25.05 ; 72.74,62.59 63.14,72.19 63.14,74.88 67.54,79.29 67.54,80.28 ; 75.31,36.12 76.31,37.12
  电源层 w1.27: 36.67,4 36.67,11.51 42.46,17.31 CN8.1 ; 36.67,4 34.93,4 H4.2 ; 36.67,4 43.04,4 44.72,5.68 H3.2 ; 67.54,80.28 67.58,80.33 67.58,82.01 66.25,83.35 54.73,83.35 50.59,79.21 H6.2 46.53,82.38 29.47,82.38 H5.2
  电源层 w2: CN8.1 43.56,17.38 41.39,19.55 v1(36.91,19.55) v1(35.82,19.55) v1(34.69,19.55)
  Bottom Layer w1.27: H5.2 24.14,79.59 18.18,79.59 15.74,82.04 15.74,85 U17.1
GND: length 112.1
  Top Layer w0.299: v1(12.56,62.19) v1(13.52,62.19) 14.03,62.19 14.67,62.82 U14.7 16.25,62.82 C17.1
  Top Layer w0.5: C2.1 v1(88.49,49.89) ; C18.1 33.6,49.61 v1(34.37,48.84) ; v1(14.78,18.31) 15.65,18.31 C9.1 16.1,17.77 C7.1 ; v1(55.69,39.74) R13.1 54.16,39.34 U5.2 ; LED5.2 34.2,50.55 v1(34.39,50.36) ; R29.2 v1(73.78,38.61) Q2.2 ; R37.2 8.94,49.1 v1(7.13,49.1) ; R7.2 14.24,19.91 v1(14.81,19.91) ; 40.43,78.88 40.45,78.86 40.45,74.79 ; v1(84.55,50.52) 84.87,50.52 C1.1 ; v1(98.69,60) U13.4 v1(98.69,54.76) U13.3 98.69,49.57 U12.4 v1(98.7,46.5) U12.3 98.7,41.32 98.58,41.2 v1(98.58,38.16) 98.58,32.98 U10.4 v1(98.69,29.71) U10.3 ; v1(12.56,62.19) 12.56,56.82 R11.2 13.79,55.12 R33.1 ; 65,80.28 64.28,79.56 LED1.2 ; R3.1 13.57,26.02 v1(13.94,26.39) ; U1.7 14.57,24.79 v1(13.94,25.43) ; v1(35.16,32.38) 35.16,31.64 36.68,30.11 LED2.2 36.68,26.82 LED3.2 36.66,26.32 36.07,25.74 34.96,25.74 34.64,25.42 U3.2 v1(34.64,23.1) 34.64,22.88 35.03,22.49 37.68,22.49 37.76,22.57 38.47,22.57
  Top Layer w1: 27.36,17.34 v1(29.35,19.34) v1(30.15,20.13) v1(30.15,21.36) C13.1
  vias: v1(11.58,63.61) v1(11.59,62.19) v1(11.61,60.77) v1(12.52,27.34) v1(12.52,26.38) v1(12.52,25.41) v1(12.55,63.61) v1(12.57,60.77) v1(13.51,63.61) v1(13.54,60.77) v1(13.82,53.06) v1(13.92,50.5) v1(13.94,27.35) v1(15.36,27.37) v1(15.36,26.4) v1(15.36,25.44) v1(20.86,82.26) v1(22.2,32.65) v1(22.2,31.27) v1(22.63,40.2) v1(22.59,38.37) v1(22.7,42.21) v1(22.88,47.5) v1(22.84,45.95) v1(23.67,32.64) v1(23.71,31.09) v1(24.04,42.21) v1(24.08,40.2) v1(24.09,38.37) v1(24.18,47.53) v1(24.34,45.87) v1(33.53,32.38) v1(33.62,39.9) v1(33.57,33.86) v1(33.66,41.43) v1(35.13,41.43) v1(35.07,33.86) v1(35.17,39.9) v1(35.44,50.36) v1(35.44,48.84) v1(59.02,63.47) v1(88.49,48.89)
VCC_5V: length 81.5
  Top Layer w0.5: 88.11,52.74 88.11,52.81 86.96,51.66 86.96,50.39 86.08,49.5 84.3,49.5 77.82,43.03 72.33,43.03 65.13,35.83 47.83,35.83 47.74,35.92 v1(47.74,37.4) 47.64,37.4 v1(46.71,38.33) 47.75,38.33 47.82,38.39 ; 86.71,59.66 86.71,57.12 88.49,55.35 88.49,52.62 ; 37.94,24.17 37.94,24.13 ; 37.94,24.13 38.98,24.13 ; 37.94,24.13 37.94,24.08
  Top Layer w1: v1(28.49,29.21) 31.24,29.21 R9.2
  Top Layer w2: L1.2 24.73,21.13 27.64,24.04 27.64,36.06 C8.1
  vias: v1(26.98,29.18) v1(27.69,29.95) v1(27.71,28.47) v1(36.44,23.81) v1(36.45,24.74) v1(37.32,24.74) v1(37.31,23.81) v1(46.68,37.4)
VCC_5V_EXT: length 102.5
  Top Layer w0.5: R8.2 v1(59.02,72.83)
  电源层 w1.27: 66.59,18.35 66.59,15.32 68.46,13.46 75.72,13.46 79.38,17.11 ; 79.38,17.11 79.38,16.75 83.03,13.09 96.09,13.09 97.06,14.06 97.06,72.84 95.18,74.71 U8.4 ; 79.38,17.11 CN6.1
  vias: v1(50.42,37.44) v1(51.48,38.36) v1(51.48,37.44)
VCC_SERVO: length 5.7
  Top Layer w1.016: 24.53,56.55 25.67,57.69 L2.2
VCCBAT: length 60.7
  Bottom Layer w1.27: CN11.3 72.37,5.16 70.62,3.41 20.45,3.41 16.23,7.64
  vias: v1(2.4,46.9) v1(2.4,45.71) v1(2.4,44.51) v1(2.4,43.32) v1(2.4,42.13) v1(2.4,40.93) v1(4.64,46.9) v1(4.64,45.71) v1(4.64,44.51) v1(4.64,43.32) v1(4.64,42.13) v1(4.64,40.93) v1(6.83,46.9) v1(6.83,45.71) v1(6.83,44.51) v1(6.83,43.32) v1(6.83,42.13) v1(6.83,40.93) v1(8.42,61.33) v1(8.44,63.19) v1(8.44,62.27) v2(12.44,50.5) v2(12.44,47.85) v3(11.71,43.09) v3(15.68,42.33)
B0: length 23.5
  Top Layer w0.254: 70.08,80.28 69.83,80.03 69.83,69.07 v1(63.47,62.71)
  Bottom Layer w0.254: 63.85,59.66 63.47,60.05 v1(63.47,62.71)
B1: length 29.5
  Top Layer w0.254: v1(64.36,62.71) 72.68,71.04 72.68,80.22 72.62,80.28
  Bottom Layer w0.254: 63.85,57.12 63.72,57.12 62.58,58.27 62.58,62.71 63.22,63.35 63.72,63.35 v1(64.36,62.71)
B2: length 29.2
  Top Layer w0.254: 75.16,80.28 75.16,72.63 v1(65.25,62.71)
  Bottom Layer w0.254: 61.31,59.66 61.31,62.14 62.93,63.75 64.21,63.75 v1(65.25,62.71)
B3: length 36.9
  Top Layer w0.254: v1(67.03,62.71) 79.99,75.67 79.99,80.03 80.24,80.28
  Bottom Layer w0.254: 61.31,57.12 61.06,57.12 60.17,58.01 60.17,61.82 62.58,64.24 65.5,64.24 v1(67.03,62.71)
B9: length 54.4
  Top Layer w0.254: v1(39.81,12.4) 38.5,13.71 38.5,18.2 45.37,25.08 46.55,25.08 47.33,25.85 47.33,27.03 48.62,28.33 U2.49
  Bottom Layer w0.254: v1(39.81,12.4) 64.72,12.4 CN11.2
B10: length 38.1
  Top Layer w0.254: R22.1 38.71,55.92 38.71,28.87 42.66,24.91 44.34,24.91 46.07,26.64
B11: length 29.7
  Top Layer w0.254: 46.07,29.18 46.83,29.18 52.8,35.15 69.54,35.15 R28.1 R29.1
B12: length 55.6
  Top Layer w0.254: 56.23,59.66 56.89,59.66 57.51,59.05 57.51,56.16 58.25,55.42 v1(58.25,54.41) ; CN5.4 74.09,17.6 73.11,16.63 71.2,16.63 70.4,17.43 70.4,19.19 64.96,24.63 64.96,27.46 64.44,27.97 63.35,27.97 62.67,28.65 62.67,29.32 61.23,30.77 59.1,30.77 v1(58.97,30.9)
  Bottom Layer w0.254: v1(58.97,30.9) 58.24,31.63 58.24,54.41 v1(58.25,54.41)
B13: length 48.9
  Top Layer w0.254: v1(59.95,54.51) 59.97,54.52 59.97,58.47 58.77,59.66 ; 71.59,18.35 71.59,20.88 67.51,24.96 67.51,27.2 66.74,27.97 65.54,27.97 65.02,28.49 65.02,30.06 63.23,31.85 v1(60.53,31.85)
  Bottom Layer w0.254: v1(60.53,31.85) 59.95,32.43 v1(59.95,54.51)
B18: length 32.2
  Top Layer w0.254: H5.3 30.8,72.93 37.49,72.93 49.89,60.53 49.89,58.35 51.12,57.12 51.15,57.12
B19: length 32.8
  Top Layer w0.254: H5.4 29.56,79.93 31.82,79.93 51.15,60.6 51.15,59.66
B20: length 38.9
  Bottom Layer w0.254: U17.15 33.63,84.89 41.35,84.89 47.33,78.91 47.33,58.44 U2.36
B22: length 47.8
  Top Layer w0.254: v1(26.57,83.34) 25.53,83.34 24.35,84.52 24.35,85.81 23.73,86.43 21.86,86.43 U17.5
  Bottom Layer w0.254: U2.38 46.08,57.81 44.98,58.91 44.98,62.23 39.79,67.41 37.47,67.41 35.93,68.95 35.93,71.16 35.05,72.04 31.93,72.04 29.26,74.71 29.26,78.62 27.24,80.64 25.91,80.64 25.34,81.21 25.34,82.11 v1(26.57,83.34)
B24: length 55.4
  Bottom Layer w0.254: U2.40 37.41,63.28 28.77,63.28 18.44,73.61 14.44,73.61 11.74,76.31 11.74,87.12 13.36,88.73 14.54,88.73 U17.2
B25: length 54.3
  Bottom Layer w0.254: U2.39 39.18,64.05 37.73,64.05 37.02,64.76 37.02,66.07 36.25,66.84 26.13,66.84 18.7,74.27 14.84,74.27 12.53,76.59 12.53,85.74 13.32,86.53 16.88,86.53 U17.4
B26: length 63.9
  Bottom Layer w0.254: U17.6 19,89.36 12.93,89.36 10.99,87.42 10.99,76.01 13.85,73.14 18.02,73.14 28.42,62.74 35.41,62.74 U2.42
B27: length 46.7
  Bottom Layer w0.254: U2.41 44.57,56.12 44.57,61.97 39.67,66.88 37.26,66.88 35.52,68.61 35.52,70.27 34.95,70.84 31.94,70.84 28.98,73.8 27.48,73.8 26.59,74.69 26.59,79 24.34,81.24 24.34,86.55 U17.8
B28: length 91.6
  Top Layer w0.299: v1(43.18,41) 44.23,39.96 v1(44.23,38.3) ; U17.10 25.7,88.04 24.32,89.42 22.47,89.42 21.93,88.88 21.93,87.22 21.15,86.43 19.86,86.43 19.33,85.91 19.33,82.46 18.27,81.39 16.02,81.39 12.36,77.74 12.36,75.9 11.99,75.53 v1(11.99,71.55)
  Bottom Layer w0.254: v1(44.23,38.3) 44.19,38.26 44.19,34.19 42.45,32.46 42.45,30.72 42.2,30.46 42.2,28.01 U2.46
  Bottom Layer w0.299: v1(11.99,71.55) 11.99,66.05 37.04,41 v1(43.18,41)
B29: length 90.8
  Top Layer w0.299: U17.12 27.03,86.52 27.03,84.08 28.71,82.4 28.71,81.4 27.81,80.49 16.39,80.49 13.27,77.37 13.27,72.56 13.9,71.92 v1(13.9,71.47) ; v1(45.78,38.69) 45.78,41.12 v1(45.22,41.69) 45.22,41.67
  Bottom Layer w0.254: U2.45 44.9,30.57 44.9,32.48 45.78,33.35 v1(45.78,38.69)
  Bottom Layer w0.299: v1(45.22,41.69) 45.05,41.69 37.24,49.49 31.3,49.49 13.9,66.89 v1(13.9,71.47)
B30: length 89.7
  Top Layer w0.254: v1(32.06,84.46) 32.06,86.46 U17.14
  Top Layer w0.299: v1(27.47,82.75) 25.66,80.94 16.2,80.94 12.81,77.55 12.81,72.37 12.98,72.21 v1(12.98,71.65) ; v1(44.42,41.45) 44.99,40.89 v1(44.99,38.56)
  Bottom Layer w0.254: v1(44.99,38.56) 44.99,33.19 U2.43 ; v1(27.47,82.75) 30.35,82.75 v1(32.06,84.46)
  Bottom Layer w0.299: v1(12.98,71.65) 12.98,65.96 37.17,41.77 43.28,41.77 43.59,41.45 v1(44.42,41.45)
B31: length 94.7
  Top Layer w0.299: U17.16 36.31,87.73 36.98,87.06 36.98,83.9 34.67,81.59 30.04,81.59 28.25,79.8 18.27,79.8 15.88,77.41 15.88,71.41 v1(15.41,70.94)
  Bottom Layer w0.254: U2.44 48.81,34.47 48.81,40.08 34.02,54.86 28.99,54.86 15.98,67.88 15.98,70.37 v1(15.41,70.94)
C0: length 99.8
  Top Layer w0.254: H4.3 29.71,10.23 31.13,11.65 33.15,11.65 34.16,10.65 34.16,4.24 36.16,2.25 86.43,2.25 97.16,12.98 97.16,20.72 93.41,24.48 90.47,24.48 90.47,25.42 89.25,26.64
C1: length 98.9
  Top Layer w0.254: H4.4 34.91,1.48 86.24,1.48 97.79,13.03 97.79,22.13 94.79,25.13 91.73,25.13 90.65,26.21 90.65,27.61 90.3,27.96 87.94,27.96 86.71,29.18
C2: length 84.6
  Top Layer w0.254: H3.3 44.42,11.46 45.91,11.46 47.09,10.28 47.09,5.83 49.83,3.09 86.58,3.09 96.19,12.7 96.19,19.95 92.07,24.07 90.07,24.07 90.07,24.22 87.64,26.64 86.71,26.64
C3: length 91.1
  Top Layer w0.254: H6.3 51.98,76.93 51.98,79.48 54.77,82.27 v1(83.66,82.27)
  Bottom Layer w0.254: 84.17,29.18 84.17,46.84 83.03,47.98 83.03,65 84,65.97 84,81.94 v1(83.66,82.27)
C4: length 12.7
  Top Layer w0.254: R23.2 86.7,33.24 85.53,32.07 85.53,28.01 84.17,26.64
C5: length 121.5
  Top Layer w0.254: v1(41.75,31.19) 41.75,67.6 37.61,71.73 21.92,71.73 17.03,76.62 CN3.2 ; 81.63,29.18 80.19,30.62 76.09,30.62 75.4,29.94 v1(75.4,21.53)
  Bottom Layer w0.254: v1(41.75,31.19) 41.75,25.8 46.02,21.53 v1(75.4,21.53)
C7: length 92.5
  Top Layer w0.254: v1(76.93,21.07) 76.93,24.66 77.98,25.71 77.98,28.77 78.4,29.18 79.09,29.18 ; 37.74,69.46 40.93,66.27 v1(40.93,31.23)
  Bottom Layer w0.254: v1(76.93,21.07) 76.72,20.86 45.86,20.86 40.93,25.79 v1(40.93,31.23)
C8: length 87.6
  Top Layer w0.254: v1(40.1,31.22) 40.09,31.23 40.09,62.96 R42.1 ; 79.09,26.64 79.05,26.6 79.05,25.45 77.9,24.3 77.9,20.42 77.42,19.95 v1(76.94,19.95)
  Bottom Layer w0.254: v1(76.94,19.95) 76.93,19.94 45.98,19.94 40.1,25.82 v1(40.1,31.22)
C16: length 24.6
  Top Layer w0.254: CN6.4 84.73,16.19 77.03,16.19 75.86,17.36 75.86,19.72 68.93,26.64
C17: length 24
  Bottom Layer w0.254: 66.39,29.18 66.67,29.18 67.65,28.2 67.65,25.84 71.25,22.24 80.71,22.24 84.57,18.38
C18: length 64.5
  Top Layer w0.254: 82.78,80.28 82.53,80.03 82.53,77.2 v1(68.04,62.71)
  Bottom Layer w0.254: v1(68.04,62.71) 67.66,62.33 67.66,56.36 65.76,54.46 65.76,51.66 62.07,47.98 62.07,31.7 62.93,30.84 63.8,30.84 65.15,29.49 65.15,27.89 66.39,26.64
C19: length 58.8
  Top Layer w0.254: 77.7,80.28 77.73,80.25 77.73,74.31 v1(66.14,62.71)
  Bottom Layer w0.254: 63.85,29.18 61.56,31.47 61.56,48.11 65.25,51.79 65.25,60.81 66.14,61.7 v1(66.14,62.71)
C20: length 13.3
  Top Layer w0.254: CN8.6 56.14,19.54 56.94,20.35 58.24,20.35 63.85,25.96 63.85,26.64
C21: length 18
  Top Layer w0.254: 61.31,29.18 62.74,27.76 62.74,26.04 57.83,21.14 54.83,21.14 53.64,19.94 CN8.5
C22: length 16.2
  Top Layer w0.254: CN8.4 51.14,19.84 53.55,22.25 58.04,22.25 61.31,25.52 61.31,26.64
C23: length 20.4
  Top Layer w0.254: 58.77,29.18 59.82,28.14 59.82,25.18 58.07,23.43 52.19,23.43 48.64,19.88 CN8.3
C24: length 34.5
  Top Layer w0.254: H3.4 40.88,7.97 40.88,19.12 45.6,23.84 56.79,23.84 58.77,25.81 58.77,26.64
C25: length 61.6
  Top Layer w0.254: H6.4 56.31,81.51 v1(58.64,81.51)
  Bottom Layer w0.254: v1(58.64,81.51) 60.42,79.73 60.42,63.86 57.37,60.81 57.37,30.33 56.23,29.18
C26: length 44.7
  Top Layer w0.254: 91.71,38.46 89.86,38.46 84.01,32.61 57.04,32.61 55.01,30.59 55.01,27.33 55.7,26.64 56.23,26.64
C27: length 46.1
  Top Layer w0.254: R25.2 89.26,41.24 89.26,39.31 83.26,33.31 56.23,33.31 53.69,30.77 53.69,29.18
C28: length 93.7
  Bottom Layer w0.254: U17.9 25.7,85.34 26.92,86.55 54.01,86.55 57.94,82.62 57.94,64.34 55.21,61.61 55.21,56.28 56.92,54.57 56.92,32.03 55.04,30.15 55.04,27.9 54.75,27.61 54.65,27.61 U2.54
C29: length 90.1
  Top Layer w0.254: v1(35.78,85.94) 35.78,84.68 33.86,82.77 30.67,82.77 U17.11
  Bottom Layer w0.254: U2.51 56.46,34.5 56.46,54.44 54.75,56.14 54.75,62.44 57.38,65.07 57.38,81.11 52.55,85.94 v1(35.78,85.94) 35.75,85.92
C30: length 44.6
  Top Layer w0.254: v1(47.06,27.83) 42.09,27.83 39.36,30.56 39.36,59.47 37.75,61.08
  Bottom Layer w0.254: v1(47.06,27.83) 49.97,27.83 51.15,26.64
C31: length 60.6
  Top Layer w0.254: 48.61,26.64 48.64,26.64 49.75,27.76 49.75,29.57 54.27,34.09 82.86,34.09 88.43,39.66 88.43,45.63 91.71,48.91 R26.2
CR: length 69.4
  Top Layer w0.254: U3.3 33.12,24.7 v1(33.12,25.18) ; v1(46.83,40.23) 47.76,40.23 51.44,43.92 77.19,43.92 81.25,47.98 R2.2 R1.2 84.32,51.37 C1.2
  Bottom Layer w0.254: v1(33.12,25.18) 33.12,28.79 44.57,40.23 v1(46.83,40.23)
D0: length 5.8
  Top Layer w0.254: R17.2 76.55,56.56 76.55,57.12
D1: length 8.5
  Top Layer w0.254: 76.55,59.66 77.82,58.39 77.82,55.73 R16.1
D2: length 5.1
  Top Layer w0.254: 79.09,57.12 79.09,54.9 R15.2
D3: length 7.8
  Top Layer w0.254: 79.09,59.66 79.09,59.16 80.36,57.89 80.36,54.08 R14.1
D12: length 13.9
  Top Layer w0.254: 74.01,59.66 73.88,59.66 72.74,58.52 72.74,56.24 69.57,53.06 69.57,48.73 R21.2
D13: length 10.2
  Top Layer w0.254: 73.88,57.12 73.88,55.98 71.34,53.44 R20.1
D14: length 15.7
  Top Layer w0.254: 71.47,59.66 71.22,59.66 70.2,58.65 70.2,56.62 65.08,51.5 65.08,49.32 R19.2
  Top Layer w0.8: 64.05,47.42 64.05,47.66 R19.2
D15: length 11.3
  Top Layer w0.254: R18.1 67.66,49.36 67.66,52.96 71.47,56.77 71.47,57.12
D16: length 28.8
  Top Layer w0.254: v1(69.06,62.71) 69.76,63.41 80.2,63.41 87.23,70.44 87.23,74.69 U8.1
  Bottom Layer w0.254: v1(69.06,62.71) 69.06,59.79 68.93,59.66
D17: length 33.2
  Top Layer w0.254: U8.2 89.81,74.65 89.81,70.87 81.66,62.71 v1(70.07,62.71)
  Bottom Layer w0.254: 68.93,57.12 69.18,57.12 70.07,58.01 v1(70.07,62.71)
D26: length 64.7
  Top Layer w0.254: 91.79,26.64 92.46,26.64 93.22,25.89 96.31,25.89 96.74,26.33 96.74,77.37 95.28,78.83 91.32,78.83 U8.7
$1N192: length 10
  Top Layer w0.254: R1.1 R2.1 82.77,54.39 82.77,58.14 81.63,59.28 81.63,59.66
$1N357: length 3.2
  Top Layer w0.5: U1.4 10.27,27.53 R3.2
$1N362: length 4.4
  Top Layer w0.5: U1.1 16.55,29.3 17.24,28.61 17.24,27.47 17.88,26.84 18.51,26.84
$1N395: length 2.6
  Top Layer w0.5: 17.53,20.36 17.53,17.83 C9.2
$1N400: length 8.3
  Top Layer w1: U1.8 16.92,23.48 C6.2
  Top Layer w1.27: L1.1 23.34,25.51 C6.2
$1N409: length 4.3
  Top Layer w0.8: R4.2 14.73,22.04 14.04,22.04 13.3,22.77 U1.6
$1N530: length 5.3
  Top Layer w0.508: Q2.1 70.59,38.52 R28.2
$1N714: length 93.9
  Top Layer w0.254: v1(68.79,44.78) 68.79,46.44 R21.1 ; v1(78.71,85.45) 78.65,85.39 44.45,85.39 39.39,80.33 39.39,77.17 H2.6
  Bottom Layer w0.254: v1(68.79,44.78) 68.79,48.54 74.71,54.46 75.92,54.46 77.82,56.36 77.82,65 78.92,66.1 78.92,85.23 v1(78.71,85.45)
$1N715: length 78.7
  Top Layer w0.254: R19.1 63.67,46.39 v1(63.67,44.71) ; v1(73.63,83.54) 50.84,83.54 H2.2
  Bottom Layer w0.254: v1(63.67,44.71) 63.67,47.56 72.74,56.63 72.74,64.87 73.86,65.99 73.86,83.31 v1(73.63,83.54)
$1N716: length 98.3
  Top Layer w0.254: R20.2 71.32,46.45 v1(71.32,44.75) ; H2.5 38,82.06 42.78,86.84 v1(81.25,86.84)
  Bottom Layer w0.254: v1(71.32,44.75) 71.32,49.74 75.15,53.57 77.19,53.57 80.49,56.87 80.49,65 81.47,65.98 81.47,86.62 v1(81.25,86.84)
$1N717: length 81.3
  Top Layer w0.254: H2.1 49.18,84.43 v1(76.04,84.43) ; R18.2 66.32,46.42 v1(66.32,44.72)
  Bottom Layer w0.254: v1(66.32,44.72) 66.32,47.3 75.28,56.26 75.28,64.87 76.41,66 76.41,84.06 v1(76.04,84.43)
$1N718: length 98
  Top Layer w0.254: v1(89.76,22.21) 89.76,22.14 88.57,20.95 88.57,17.32 83.48,12.24 52.46,12.24 50.8,10.58 50.8,8.02 H1.6 ; R17.1 v1(72.87,50.27)
  Bottom Layer w0.254: v1(72.87,50.27) 72.87,47.22 72.21,46.56 72.21,32.59 70.2,30.58 70.2,26.01 73.23,22.99 88.98,22.99 v1(89.76,22.21)
$1N719: length 88.1
  Top Layer w0.254: v1(91.53,22.21) 89.74,20.42 89.74,16.78 77.99,5.03 58.87,5.03 H1.2 ; R15.1 v1(77.06,50.27)
  Bottom Layer w0.254: 75.23,46.68 75.23,26 76.84,24.39 89.35,24.39 v1(91.53,22.21) ; v1(77.06,50.27) 77.06,48.36 75.41,46.71
$1N720: length 91.8
  Top Layer w0.254: H1.5 54.28,11.35 83.35,11.35 89.19,17.2 89.19,20.82 90.61,22.24 v1(90.67,22.24) ; R16.2 v1(74.96,50.27)
  Bottom Layer w0.254: v1(90.67,22.24) 89.11,23.8 74.88,23.8 72.85,25.83 72.85,46.44 74.96,48.55 v1(74.96,50.27)
$1N721: length 93.2
  Top Layer w0.254: v1(92.42,22.2) 92.29,22.08 92.29,21.79 90.19,19.68 90.19,16.13 77.69,3.63 58.69,3.63 55.84,6.49 55.84,7.84 H1.1 ; R14.2 v1(79.16,50.14)
  Bottom Layer w0.254: v1(79.16,50.14) 78.96,49.95 78.96,47.98 77.82,46.84 77.82,25.83 78.71,24.94 89.68,24.94 v1(92.42,22.2)
$1N974: length 32.5
  Top Layer w1.27: ZD2.1 v1(9.06,57.79) S1.3
  Top Layer w2.032: 6.98,37.31 v1(8.99,37.31)
  Bottom Layer w1.27: v1(8,58.82) 8.99,57.84 v1(8.99,38.35) v1(8.99,37.31) v1(8.99,36.29)
$1N981: length 8.4
  Top Layer w1.27: R37.1 9.01,53.72 ; 9.01,53.72 8.37,53.09 S1.1 ; 9.01,53.72 ZD2.2
$1N982: length 25.3
  Top Layer w1.016: Q3.2 0.86,37.37 0.86,57.89 S1.2
$1N1264: length 4.5
  Top Layer w0.5: R13.2 53.6,40.29 U5.3
$1N1431: length 7.1
  Top Layer w0.762: R33.2 10.97,55.56 10.97,58.97 9.66,60.27 9.65,60.27
$1N1436: length 8.8
  Top Layer w0.5: C19.1 17.25,64.67 16.54,65.37 15.02,65.37 14.67,65.72 11.27,65.72 U14.1
$1N1469: length 2.3
  Top Layer w0.5: R32.1 18.74,59.51 C17.2
$1N1483: length 3.2
  Top Layer w0.3: U14.6 15.89,61.55 17.33,60.11 17.33,59.42
$1N1533: length 8.9
  Top Layer w0.5: 92.77,54.14 R26.1 ; 92.77,54.14 94.98,56.36 U13.2 ; 92.77,54.14 92.84,54.14 U13.1
$1N1534: length 9.9
  Top Layer w0.5: R25.1 93.62,42.18 U12.1 U12.2
$1N1535: length 9
  Top Layer w0.5: 94.88,35.2 93.12,36.96 92.77,36.96 ; 92.77,36.96 94.88,39.07 94.88,41.2 ; 92.77,36.96 R24.1
$1N1536: length 9.9
  Top Layer w0.254: 91.85,31.73 R23.1
  Top Layer w0.5: U10.2 93.84,31.73 91.85,31.73 94.98,28.59 U10.1
$1N1878: length 2.2
  Top Layer w0.254: J10.1 34.07,61.08 R35.2
$1N1888: length 2.2
  Top Layer w0.254: R22.2 34.12,56.89 J3.1
$1N1891: length 2.3
  Top Layer w0.508: 34.96,26.79 R10.1
$1N1900: length 2.5
  Top Layer w0.762: R12.1 30.07,52.33 LED5.1
$1N1901: length 2.2
  Top Layer w0.508: 33.17,29.08 35.38,29.08
$1N1902: length 2.1
  Top Layer w0.508: R8.1 LED1.1
$1N17375: length 8.8
  Top Layer w0.508: Q2.3 79.62,40.76 BUZZER1.2
$1N17379: length 9.4
  Top Layer w0.508: BUZZER1.1 79.93,36.07 R27.2
$1N18894: length 2.2
  Top Layer w0.254: R42.2 36.22,65.23 J12.1
$1N26015: length 2.2
  Top Layer w0.254: R43.2 34.09,69.4 J13.1
$1N38676: length 3.3
  Top Layer w0.254: R44.2 23.16,83.06 U17.7

## Copper pours and planes (outline as drawn; the poured copper is in the pictures)
3V3 on Top Layer: 31.13,22.03 37.52,22.03 37.52,15.43 31.29,15.43 31.12,15.6 31.12,22.03
GND on Top Layer: 32.58,50.92 35.49,50.92 36.45,49.95 36.45,31.9 35.91,31.35 31.36,31.35 30.91,31.79 30.91,50.21 31.15,50.45 32.13,50.45 32.58,50.89
GND on Top Layer: 11.68,57.52 11.68,55.88 12.48,55.08 13.25,55.08 13.25,48.27 13.43,48.09 14.57,48.09 14.71,48.23 14.71,55.05 12.75,57.01 12.75,57.51 11.7,57.51
GND on Top Layer: -12.6,98.12 105.43,98.12 105.43,-8.25 -12.6,-8.25
GND on Top Layer: 19.2,48.07 24.47,48.07 25.4,47.14 25.4,31.11 23.77,29.49 18.69,29.49 18.69,47.56
GND on Bottom Layer: -19,108.21 -14.11,103.32 113.9,103.32 113.9,-16.87 112.23,-18.55 -14.67,-18.55 -19,-14.21
GND on 接地层: -3.27,94.38 -1.49,92.6 103.44,92.6 103.44,-5.01 -0.41,-5.01 -4.16,-1.26 -4.16,93.49
VCC_5V on Top Layer: 46.25,38.78 48.33,38.78 48.45,38.66 48.45,37.2 48.26,37.01 46.25,37.01
VCC_5V on Top Layer: 35.14,25.33 39.58,25.33 39.58,22.94 35.64,22.94 35.14,23.44
VCC_5V on Top Layer: 12.18,14.74 12.14,11.97 20.54,11.98 26.4,17.84 26.4,23.38 26.11,23.67 25.66,23.71 20.66,23.71 20.66,18.23 17.18,14.74 15.23,14.74
VCC_5V on 电源层: 26.55,39.36 48.36,39.36 48.36,23.52 26.55,23.52
VCC_5V_EXT on Top Layer: 49.69,38.85 51.91,38.85 51.99,38.76 51.99,37.03 49.81,37.03 49.69,37.16
VCC_5V_EXT on 电源层: 19.93,111.59 107.36,111.59 107.36,-5.89 19.93,-5.89
VCC_SERVO on Top Layer: 24.26,72.16 24.26,54.39 26.23,52.42 26.23,45.73 25.12,44.62 25.12,42 30.38,42 30.83,42.45 30.83,46.74 29.22,48.36 29.22,53.32 30.03,54.13 32.95,54.13 32.95,72.21 24.31,72.21
VCCBAT on Top Layer: 10.9,53.21 12.55,53.21 13.06,52.7 13.06,46.86 14.44,45.48 18.51,45.48 18.51,41.61 18.04,41.14 14.29,41.14 13.34,42.09 9.48,42.09 9.15,42.42 9.15,46.6 10.42,47.86 10.42,52.81 10.87,53.27 10.9,53.25
VCCBAT on Top Layer: 7.67,63.47 10.35,63.47 10.51,63.31 10.51,61.02 10.34,60.85 7.89,60.85 7.66,61.08 7.66,63.45
VCCBAT on 电源层: -15.21,104.18 20.55,104.18 20.55,-2.45 -15.21,-2.45
$1N350 on Top Layer: 9.15,41.9 9.25,41.8 13.41,41.8 15.83,39.38 17.04,39.38 18.68,37.73 18.68,28.76 17.9,28.76 16.54,30.12 15.62,30.12 15.24,29.74 15.24,27.97 12.73,27.97 12.73,29.88 9.15,33.47
$1N385 on Top Layer: 12.89,18.97 14.23,18.97 14.23,15.03 12.89,15.03
$1N386 on Top Layer: 10.59,24.29 12.73,24.29 12.73,16.84 10.59,16.84
$1N974 on Top Layer: 4.65,38.78 9.46,38.78 10.3,37.94 10.3,32.31 6.69,28.7 1.11,28.7 0.9,28.9 0.9,33.15 1.28,33.53 2.55,33.53 4.65,35.63
$1N1460 on Top Layer: 14,60.91 16.15,60.91 16.5,60.56 16.5,58.77 19.48,55.79 19.48,49.8 14.93,49.8 14.93,55.46 13.08,57.3 13.08,60.01 14.04,60.96 14.04,60.95
$1N1474 on Top Layer: 14.86,65.36 23.49,65.36 23.71,65.15 23.71,59.31 19.73,55.34 18.63,55.34 18.36,55.6 18.36,57.46 19.73,58.83 19.73,63.32 19.65,63.4 14.61,63.4 14.61,65.11
$1N3397 on Top Layer: 19.71,58.19 24.28,58.19 24.28,53.57 24.83,53.02 24.9,53.02 25.67,52.25 25.67,49.58 19.78,49.58 19.78,58.13

Small or netless copper shapes (teardrops, artwork), in the pictures only: 4 on Top Layer

## Text on the board
Top Layer: 2024/4/12 | DZXS-臻图 | DJTU
Top Silkscreen Layer: 3v3 | GND | VCC | C7 | C8 | C30 | B10 | C5 | C6 | 3V3 | B19 | B18 | NC | C23 | C22 | C25 | C3 | C21 | C20 | 5V | B0 | B13 | B1 | B12 | B2 | C19 | B3 | C18 | D16 | D17 | C1 | C0 | C24 | C2 | C17 | C16 | D13 | D12 | D15 | D14 | D1 | D0 | D3 | D2 | SERVO | + | 电机电源2 | 电机电源1 | 编码器4 | 编码器1 | 电机信号2 | 编码器2 | 姿态传感器 | 编码器3 | 电机信号1 | 5VEXT | UART1 | 显示屏 | 无线串口 | - | UART4
